# EAGLE design Charger Control Board rev9 (EAGLE 9.6.2)

## Sheet 1 of 4: Main
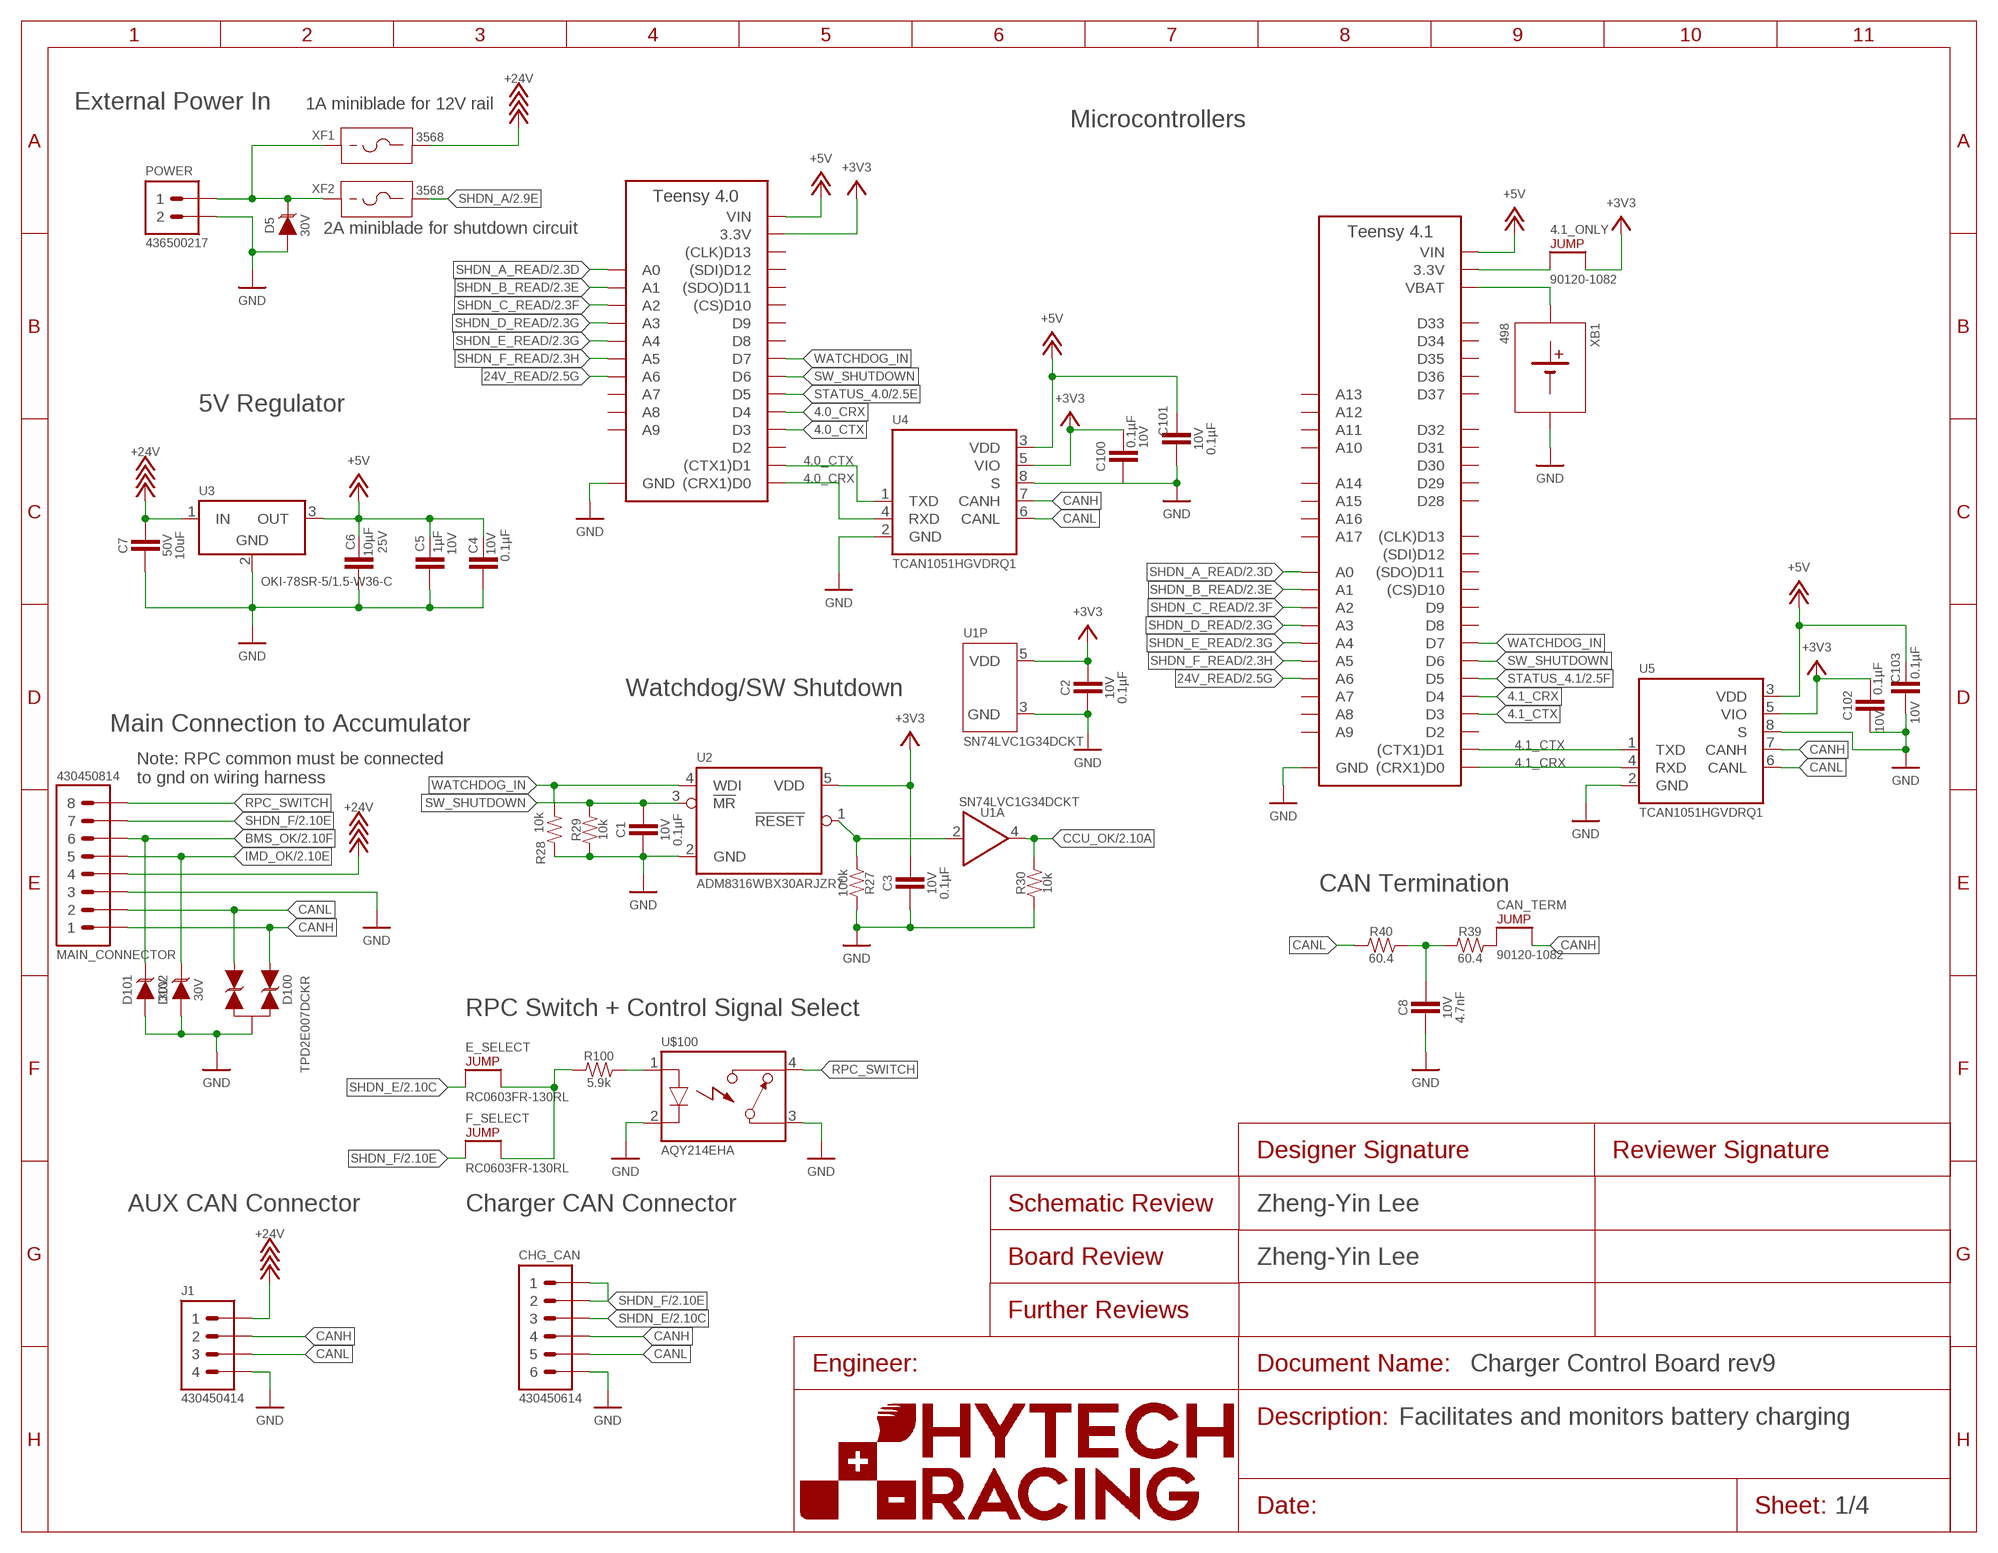
[diagram p0: schematic, sheet 1]
FRAME1 (FRAME): DESCRIPTION_1: Facilitates and monitors battery charging; DESIGNER_BOARD: Zheng-Yin Lee; DESIGNER_SCHEMATIC: Zheng-Yin Lee

### Parts
4.1_ONLY  JUMPER__1X02  [1X02]
A1  TEENSY_4.1  [TEENSY_LONG_EXT]
A2  TEENSY_4.0TH  [TEENSY_SHORT]
C1  CAPACITOR_0603_10V_0.1UF  [0603-CAP]
C2  CAPACITOR_0603_10V_0.1UF  [0603-CAP]
C3  CAPACITOR_0603_10V_0.1UF  [0603-CAP]
C4  CAPACITOR_0603_10V_0.1UF  [0603-CAP]
C5  CAPACITOR_0603_10V_1UF  [0603-CAP]
C6  CAPACITOR_0603_25V_10UF  [0603-CAP]
C7  CAPACITOR_0805_50V_10UF  [0805-CAP]
C8  CAPACITOR_0603_10V_4.7NF  [0603-CAP]
C100  CAPACITOR_0603_10V_0.1UF  [0603-CAP]
C101  CAPACITOR_0603_10V_0.1UF  [0603-CAP]
C102  CAPACITOR_0603_10V_0.1UF  [0603-CAP]
C103  CAPACITOR_0603_10V_0.1UF  [0603-CAP]
CAN_TERM  JUMPER__1X02  [1X02]
CHG_CAN  CONNECTOR-6_MF_T_V_  [MOLEX_MICROFIT_PTH_VERTICAL_06_DUAL]
D5  TVS_DO-214AA_30V  [DO-214AA]
D100  TVS_BIDIRECTIONAL_DUAL  [SC-70-3]
D101  TVS_DO-214AA_30V  [DO-214AA]
D102  TVS_DO-214AA_30V  [DO-214AA]
E_SELECT  JUMPER_0603_  [0603-RES]
F_SELECT  JUMPER_0603_  [0603-RES]
J1  CONNECTOR-4_μF_T_V_BLACK  [MOLEX_MICROFIT_PTH_VERTICAL_04_DUAL]
MAIN_CONNECTOR  CONNECTOR-8_MF_T_V_  [MOLEX_MICROFIT_PTH_VERTICAL_08_DUAL]
POWER  CONNECTOR-2_μF_T_V_  CONNECTOR-2_μF_T_V_BLACK  [MOLEX_MICROFIT_PTH_VERTICAL_02_DUAL]
R27  RESISTOR_0603_100K  [0603-RES]
R28  RESISTOR_0603_10K  [0603-RES]
R29  RESISTOR_0603_10K  [0603-RES]
R30  RESISTOR_0603_10K  [0603-RES]
R39  RESISTOR_0603_60.4  [0603-RES]
R40  RESISTOR_0603_60.4  [0603-RES]
R100  RESISTOR_0603_5.9K  [0603-RES]
U1  LOGICGATE_BUFFER  [SC-70-5]
U2  ADM8316WBX30  [SOT-23-5]
U3  VOLTAGE_REGULATOR_MODULE_OKI-78SR_5V  [OKI-78SR]
U4  TCAN1051HQV-Q1  [SOIC-08(NARROW,0.15")]
U5  TCAN1051HQV-Q1  [SOIC-08(NARROW,0.15")]
U$100  RELAY_SOLIDSTATE_NO_DIP-4  [DIP-4]
XB1  BATTERY_HOLDER_KEYSTONE_498  [498]
XF1  FUSE_HOLDER_MINIBLADEPTH  [3568]
XF2  FUSE_HOLDER_MINIBLADEPTH  [3568]

### Nets
4.0_CRX: A2.D0((CRX1)D0) A2.D4 U4.4(RXD)
4.0_CTX: A2.D1((CTX1)D1) A2.D3 U4.1(TXD)
4.1_CRX: A1.D0((CRX1)D0) A1.D4 U5.4(RXD)
4.1_CTX: A1.D1((CTX1)D1) A1.D3 U5.1(TXD)
24V_READ: A1.D20(A6) A2.D20(A6) ; also sheet 2
+3V3: 4.1_ONLY.2 A2.3.3V C2.2 C3.2 C100.2 C102.2 U1.5(P:VDD) U2.5(VDD) U4.5(VIO) U5.5(VIO) ; also sheet 2
+5V: A1.VIN A2.VIN C4.2 C5.1 C6.1 C101.2 C103.2 U3.3(OUT) U4.3(VDD) U5.3(VDD) ; also sheet 2
+24V: C7.1 J1.1 MAIN_CONNECTOR.4 U3.1(IN) XF1.3 XF1.4 ; also sheet 2
BMS_OK: D101.2(C) MAIN_CONNECTOR.6 ; also sheet 2
CANH: CAN_TERM.2 CHG_CAN.4 D100.1(C1) J1.2 MAIN_CONNECTOR.1 U4.7(CANH) U5.7(CANH)
CANL: CHG_CAN.5 D100.2(C2) J1.3 MAIN_CONNECTOR.2 R40.1 U4.6(CANL) U5.6(CANL)
CCU_OK: R30.2 U1.4(A:OUT) ; also sheet 2
GND: A1.AGND/GND(GND) A1.GND A1.GND@2(GND) A2.AGND/GND(GND) A2.GND C1.1 C2.1 C3.1 C4.1 C5.2 C6.2 C7.2 C8.2 C100.1 C101.1 C102.1 C103.1 CHG_CAN.6 D5.1(A) D100.3(A) D101.1(A) D102.1(A) J1.4 MAIN_CONNECTOR.3 POWER.2 R27.2 R28.2 R29.1 R30.1 U1.3(P:GND) U2.2(GND) U3.2(GND) U4.2(GND) U4.8(S) U5.2(GND) U5.8(S) U$100.2(CONTROL-) U$100.3(CONTACT1) XB1.2(MINUS) ; also sheet 2
IMD_OK: D102.2(C) MAIN_CONNECTOR.5 ; also sheet 2
N$1: D5.2(C) POWER.1 XF1.1 XF1.2 XF2.1 XF2.2
N$2: R27.1 U1.2(A:IN) U2.1(!RESET!)
N$4: CAN_TERM.1 R39.2
N$5: E_SELECT.2 F_SELECT.2 R100.1
N$8: A1.VBAT XB1.1(PLUS)
N$9: C8.1 R39.1 R40.2
N$10: R100.2 U$100.1(CONTROL+)
N$36: 4.1_ONLY.1 A1.3V3(3.3V) A1.3V3@2(3.3V) A1.3V3@3(3.3V)
RPC_SWITCH: MAIN_CONNECTOR.8 U$100.4(CONTACT2)
SHDN_A: XF2.3 XF2.4 ; also sheet 2
SHDN_A_READ: A1.D14(A0) A2.D14(A0) ; also sheet 2
SHDN_B_READ: A1.D15(A1) A2.D15(A1) ; also sheet 2
SHDN_C_READ: A1.D16(A2) A2.D16(A2) ; also sheet 2
SHDN_D_READ: A1.D17(A3) A2.D17(A3) ; also sheet 2
SHDN_E: CHG_CAN.3 E_SELECT.1 ; also sheet 2
SHDN_E_READ: A1.D18(A4) A2.D18(A4) ; also sheet 2
SHDN_F: CHG_CAN.1 CHG_CAN.2 F_SELECT.1 MAIN_CONNECTOR.7 ; also sheet 2
SHDN_F_READ: A1.D19(A5) A2.D19(A5) ; also sheet 2
STATUS_4.0: A2.D5 ; also sheet 2
STATUS_4.1: A1.D5 ; also sheet 2
SW_SHUTDOWN: A1.D6 A2.D6 C1.2 R29.2 U2.3(!MR!)
WATCHDOG_IN: A1.D7 A2.D7 R28.1 U2.4(WDI)
Unconnected: A1.D2 A1.D8 A1.D9 A1.D10((CS)D10) A1.D11((SDO)D11) A1.D12((SDI)D12) A1.D13((CLK)D13) A1.D21(A7) A1.D22(A8) A1.D23(A9) A1.D24(A10) A1.D25(A11) A1.D26(A12) A1.D27(A13) A1.D28 A1.D29 A1.D30 A1.D31 A1.D32 A1.D33 A1.D34 A1.D35 A1.D36 A1.D37 A1.D38(A14) A1.D39(A15) A1.D40(A16) A1.D41(A17) A2.D2 A2.D8 A2.D9 A2.D10((CS)D10) A2.D11((SDO)D11) A2.D12((SDI)D12) A2.D13((CLK)D13) A2.D21(A7) A2.D22(A8) A2.D23(A9)

### Notes on the sheet
- External Power In | 1A miniblade for 12V rail
- Microcontrollers
- 2A miniblade for shutdown circuit
- 5V Regulator
- Watchdog/SW Shutdown
- Main Connection to Accumulator
- Note: RPC common must be connected
  to gnd on wiring harness
- CAN Termination
- RPC Switch + Control Signal Select
- AUX CAN Connector | Charger CAN Connector

## Sheet 2 of 4: Shutdown Cicruit
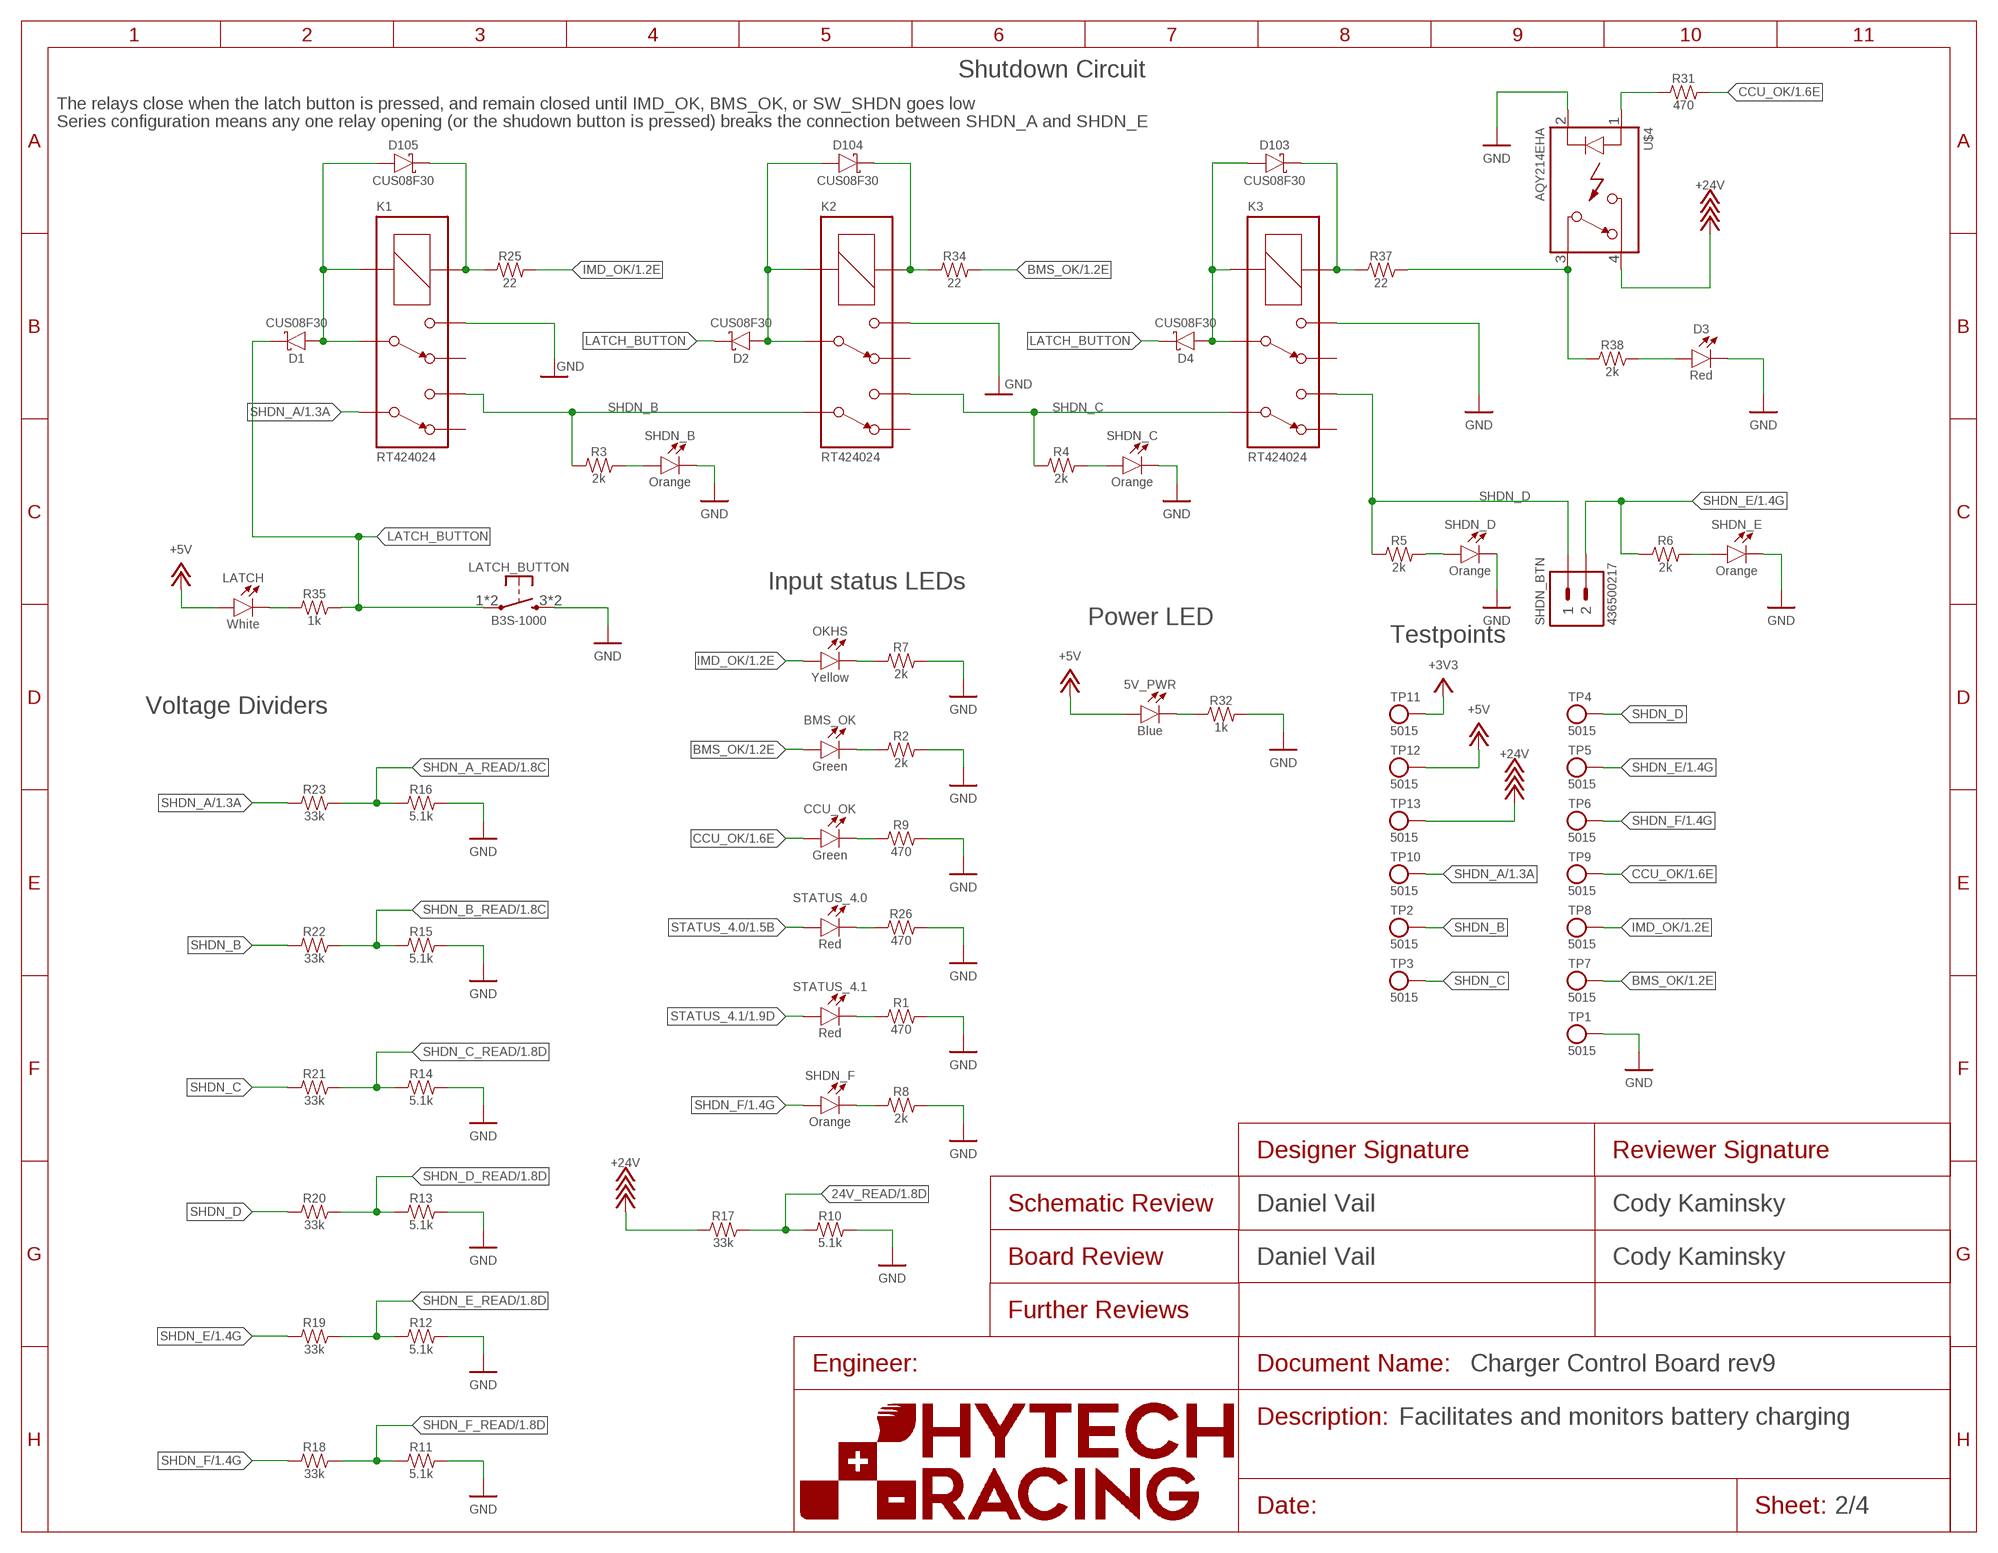
[diagram p1: schematic, sheet 2]
FRAME2 (FRAME): DESCRIPTION_1: Facilitates and monitors battery charging; DESIGNER_BOARD: Daniel Vail; DESIGNER_SCHEMATIC: Daniel Vail; REVIEWER_BOARD: Cody Kaminsky; REVIEWER_SCHEMATIC: Cody Kaminsky

### Parts
5V_PWR  LED_0603_BLUE  [0603-LED]
BMS_OK  LED_0603_GREEN  [0603-LED]
CCU_OK  LED_0603_GREEN  [0603-LED]
D1  SCHOTTKY_SOD323_30V  [SOD-323]
D2  SCHOTTKY_SOD323_30V  [SOD-323]
D3  LED_0603_RED  [0603-LED]
D4  SCHOTTKY_SOD323_30V  [SOD-323]
D103  SCHOTTKY_SOD323_30V  [SOD-323]
D104  SCHOTTKY_SOD323_30V  [SOD-323]
D105  SCHOTTKY_SOD323_30V  [SOD-323]
K1  RELAY_DPDT_RT424024TH  [RT*2*]
K2  RELAY_DPDT_RT424024TH  [RT*2*]
K3  RELAY_DPDT_RT424024TH  [RT*2*]
LATCH  LED_0603_WHITE  [0603-LED]
LATCH_BUTTON  BUTTON  [B3S-100X]
OKHS  LED_0603_YELLOW  [0603-LED]
R1  RESISTOR_0603_470  [0603-RES]
R2  RESISTOR_0603_2K  [0603-RES]
R3  RESISTOR_0603_2K  [0603-RES]
R4  RESISTOR_0603_2K  [0603-RES]
R5  RESISTOR_0603_2K  [0603-RES]
R6  RESISTOR_0603_2K  [0603-RES]
R7  RESISTOR_0603_2K  [0603-RES]
R8  RESISTOR_0603_2K  [0603-RES]
R9  RESISTOR_0603_470  [0603-RES]
R10  RESISTOR_0603_5.1K  [0603-RES]
R11  RESISTOR_0603_5.1K  [0603-RES]
R12  RESISTOR_0603_5.1K  [0603-RES]
R13  RESISTOR_0603_5.1K  [0603-RES]
R14  RESISTOR_0603_5.1K  [0603-RES]
R15  RESISTOR_0603_5.1K  [0603-RES]
R16  RESISTOR_0603_5.1K  [0603-RES]
R17  RESISTOR_0603_33K  [0603-RES]
R18  RESISTOR_0603_33K  [0603-RES]
R19  RESISTOR_0603_33K  [0603-RES]
R20  RESISTOR_0603_33K  [0603-RES]
R21  RESISTOR_0603_33K  [0603-RES]
R22  RESISTOR_0603_33K  [0603-RES]
R23  RESISTOR_0603_33K  [0603-RES]
R25  RESISTOR_0603_22  [0603-RES]
R26  RESISTOR_0603_470  [0603-RES]
R31  RESISTOR_0603_470  [0603-RES]
R32  RESISTOR_0603_1K  [0603-RES]
R34  RESISTOR_0603_22  [0603-RES]
R35  RESISTOR_0603_1K  [0603-RES]
R37  RESISTOR_0603_22  [0603-RES]
R38  RESISTOR_0603_2K  [0603-RES]
SHDN_B  LED_0603_ORANGE  [0603-LED]
SHDN_BTN  CONNECTOR-2_μF_T_V_  CONNECTOR-2_μF_T_V_BLACK  [MOLEX_MICROFIT_PTH_VERTICAL_02_DUAL]
SHDN_C  LED_0603_ORANGE  [0603-LED]
SHDN_D  LED_0603_ORANGE  [0603-LED]
SHDN_E  LED_0603_ORANGE  [0603-LED]
SHDN_F  LED_0603_ORANGE  [0603-LED]
STATUS_4.0  LED_0603_RED  [0603-LED]
STATUS_4.1  LED_0603_RED  [0603-LED]
TP1  TEST_POINT  [5015]
TP2  TEST_POINT  [5015]
TP3  TEST_POINT  [5015]
TP4  TEST_POINT  [5015]
TP5  TEST_POINT  [5015]
TP6  TEST_POINT  [5015]
TP7  TEST_POINT  [5015]
TP8  TEST_POINT  [5015]
TP9  TEST_POINT  [5015]
TP10  TEST_POINT  [5015]
TP11  TEST_POINT  [5015]
TP12  TEST_POINT  [5015]
TP13  TEST_POINT  [5015]
U$4  RELAY_SOLIDSTATE_NO  [DIP-4@1]

### Nets
24V_READ: R10.1 R17.2 ; also sheet 1
+3V3: TP11.1 ; also sheet 1
+5V: 5V_PWR.2(A) LATCH.2(A) TP12.1 ; also sheet 1
+24V: R17.1 TP13.1 U$4.4(CONTACT2) ; also sheet 1
BMS_OK: BMS_OK.2(A) R34.2 TP7.1 ; also sheet 1
CCU_OK: CCU_OK.2(A) R31.2 TP9.1 ; also sheet 1
GND: D3.1(C) K1.14 K2.14 K3.14 LATCH_BUTTON.3(S) LATCH_BUTTON.4(S) R1.2 R2.2 R7.2 R8.2 R9.2 R10.2 R11.2 R12.2 R13.2 R14.2 R15.2 R16.2 R26.2 R32.2 SHDN_B.1(C) SHDN_C.1(C) SHDN_D.1(C) SHDN_E.1(C) TP1.1 U$4.2(CONTROL-) ; also sheet 1
IMD_OK: OKHS.2(A) R25.2 TP8.1 ; also sheet 1
LATCH_BUTTON: D1.C D2.C D4.C LATCH_BUTTON.1(P) LATCH_BUTTON.2(P) R35.2
N$3: R8.1 SHDN_F.1(C)
N$6: R31.1 U$4.1(CONTROL+)
N$11: D1.A D105.A K1.11 K1.A2(COIL-)
N$12: D105.C K1.A1(COIL+) R25.1
N$13: D104.C K2.A1(COIL+) R34.1
N$14: D2.A D104.A K2.11 K2.A2(COIL-)
N$15: D103.C K3.A1(COIL+) R37.1
N$16: R37.2 R38.1 U$4.3(CONTACT1)
N$17: LATCH.1(C) R35.1
N$18: R5.2 SHDN_D.2(A)
N$19: R6.2 SHDN_E.2(A)
N$20: D4.A D103.A K3.11 K3.A2(COIL-)
N$21: D3.2(A) R38.2
N$22: R4.2 SHDN_C.2(A)
N$23: R3.2 SHDN_B.2(A)
N$29: OKHS.1(C) R7.1
N$30: BMS_OK.1(C) R2.1
N$31: CCU_OK.1(C) R9.1
N$33: R26.1 STATUS_4.0.1(C)
N$35: 5V_PWR.1(C) R32.1
N$39: R1.1 STATUS_4.1.1(C)
SHDN_A: K1.21 R23.1 TP10.1 ; also sheet 1
SHDN_A_READ: R16.1 R23.2 ; also sheet 1
SHDN_B: K1.24 K2.21 R3.1 R22.1 TP2.1
SHDN_B_READ: R15.1 R22.2 ; also sheet 1
SHDN_C: K2.24 K3.21 R4.1 R21.1 TP3.1
SHDN_C_READ: R14.1 R21.2 ; also sheet 1
SHDN_D: K3.24 R5.1 R20.1 SHDN_BTN.1 TP4.1
SHDN_D_READ: R13.1 R20.2 ; also sheet 1
SHDN_E: R6.1 R19.1 SHDN_BTN.2 TP5.1 ; also sheet 1
SHDN_E_READ: R12.1 R19.2 ; also sheet 1
SHDN_F: R18.1 SHDN_F.2(A) TP6.1 ; also sheet 1
SHDN_F_READ: R11.1 R18.2 ; also sheet 1
STATUS_4.0: STATUS_4.0.2(A) ; also sheet 1
STATUS_4.1: STATUS_4.1.2(A) ; also sheet 1
Unconnected: K1.12 K1.22 K2.12 K2.22 K3.12 K3.22

### Notes on the sheet
- Shutdown Circuit
- The relays close when the latch button is pressed, and remain closed until IMD_OK, BMS_OK, or SW_SHDN goes low
- Series configuration means any one relay opening (or the shudown button is pressed) breaks the connection between SHDN_A and SHDN_E
- Input status LEDs
- Power LED
- Testpoints
- Voltage Dividers

## Sheet 3 of 4
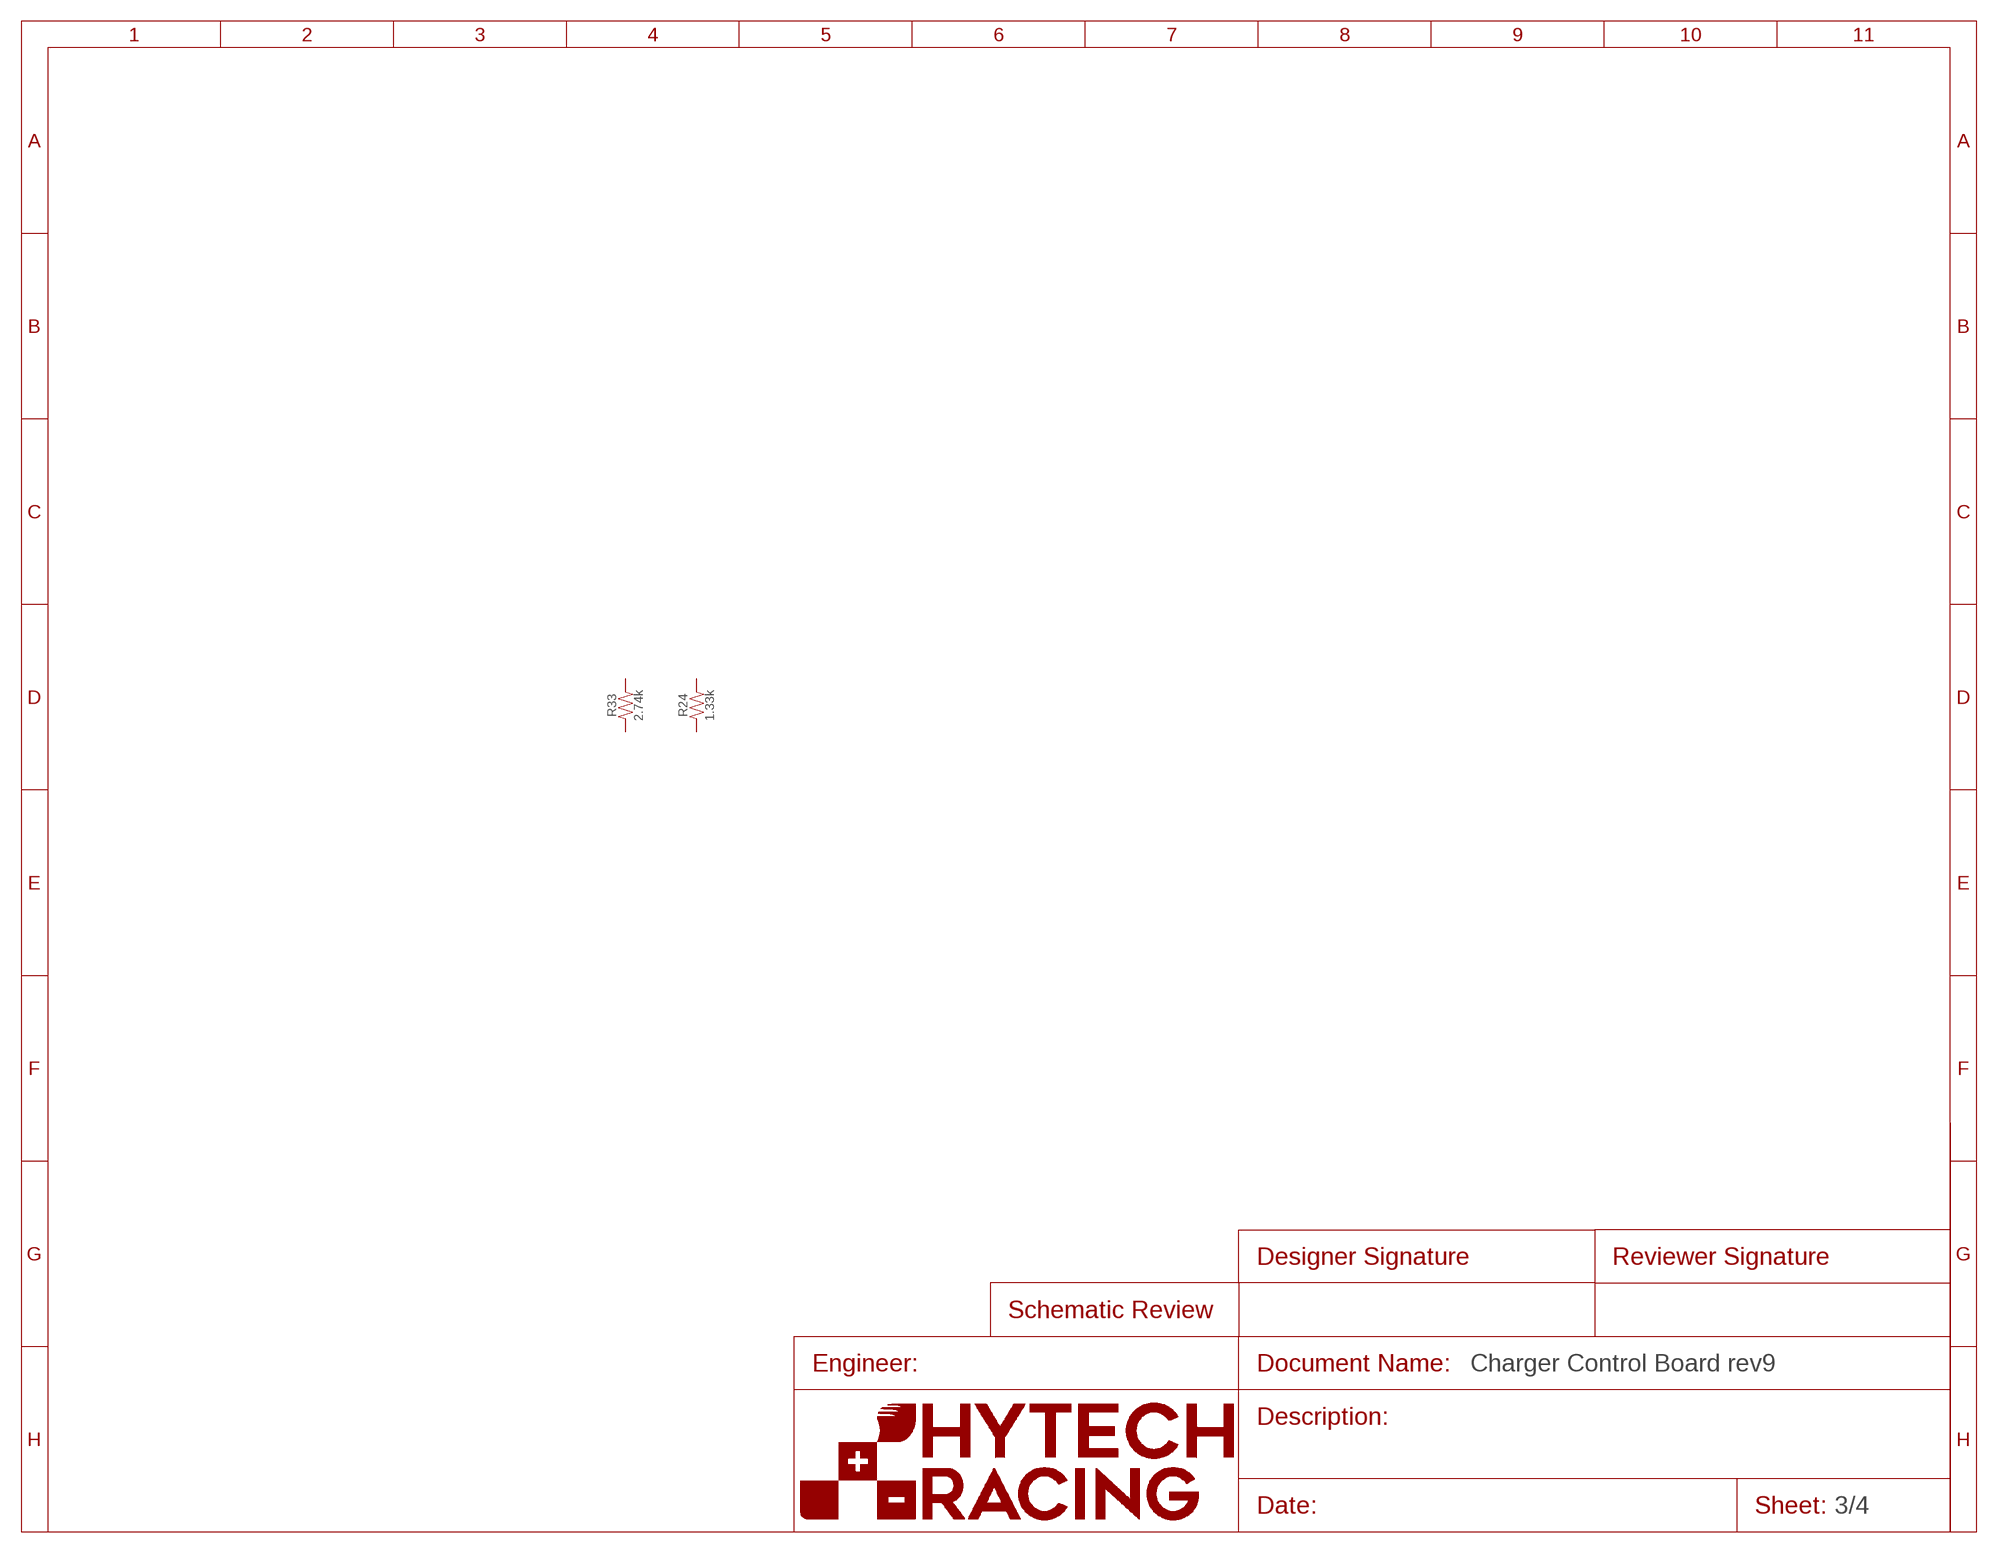
[diagram p2: schematic, sheet 3]

### Parts
R24  RESISTOR_0603_1.33K  [0603-RES]
R33  RESISTOR_0603_2.74K  [0603-RES]
Unconnected: R24.1 R24.2 R33.1 R33.2

## Sheet 4 of 4: Ordering Components
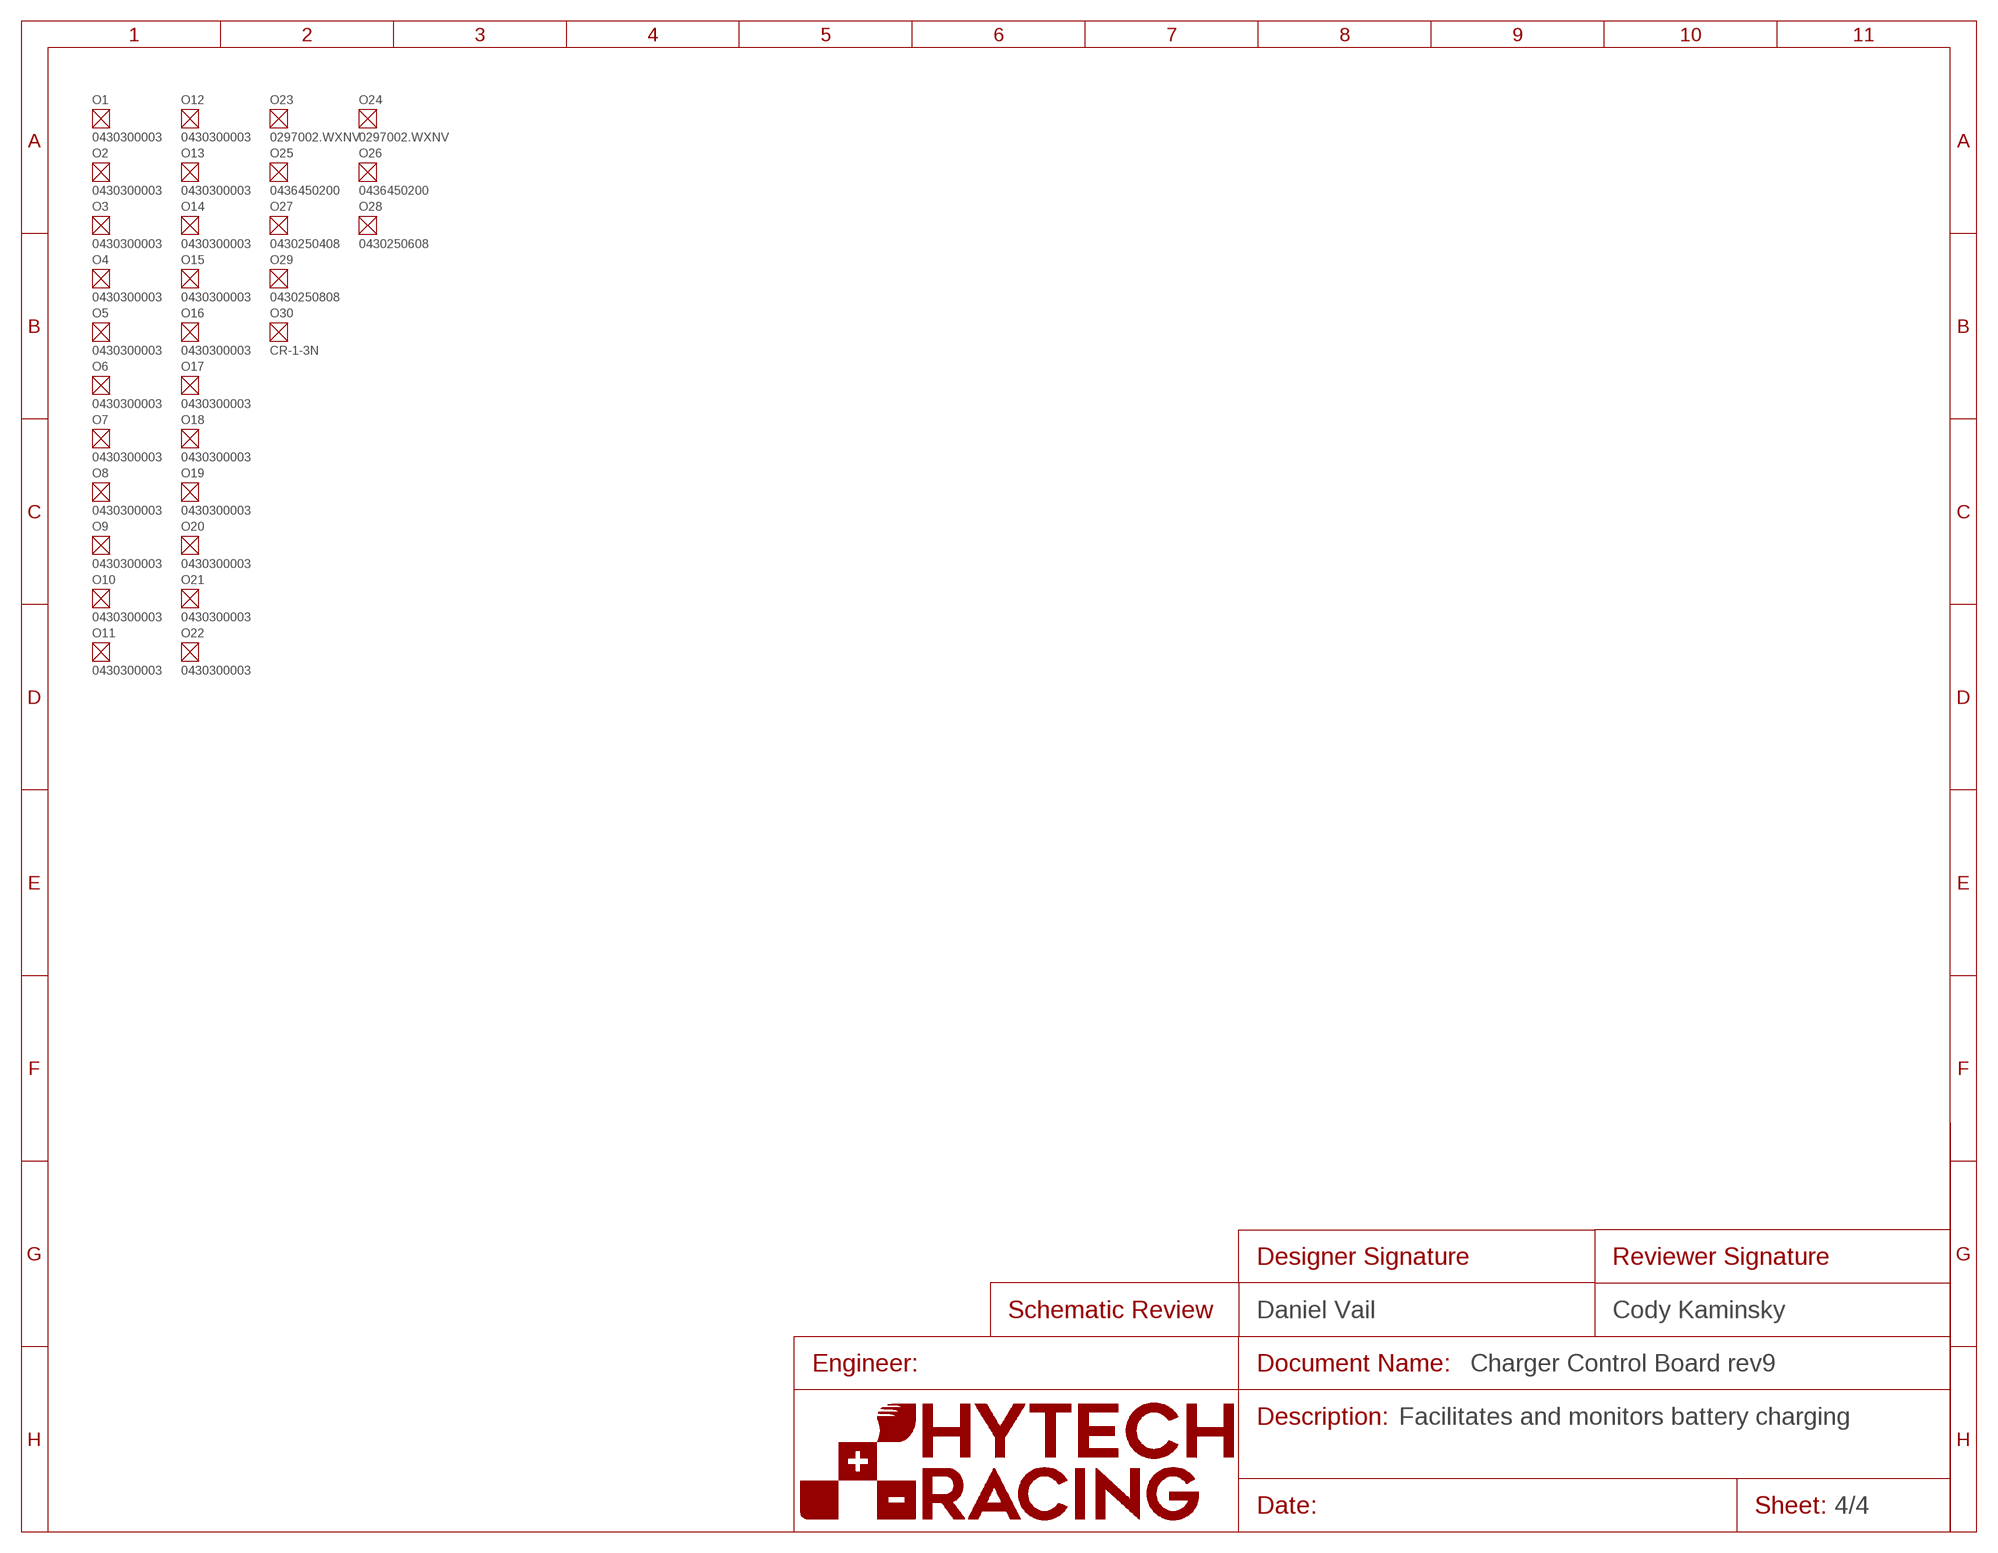
[diagram p3: schematic, sheet 4]
O1 (CRIMP_MICROFIT_20-24): DKPN: WM2776CT-ND; GAUGE: 20-24; MANUFACTURER: Molex; MOPN: 538-43030-0003; MPN: 0430300003
O2 (CRIMP_MICROFIT_20-24): DKPN: WM2776CT-ND; GAUGE: 20-24; MANUFACTURER: Molex; MOPN: 538-43030-0003; MPN: 0430300003
O3 (CRIMP_MICROFIT_20-24): DKPN: WM2776CT-ND; GAUGE: 20-24; MANUFACTURER: Molex; MOPN: 538-43030-0003; MPN: 0430300003
O4 (CRIMP_MICROFIT_20-24): DKPN: WM2776CT-ND; GAUGE: 20-24; MANUFACTURER: Molex; MOPN: 538-43030-0003; MPN: 0430300003
O5 (CRIMP_MICROFIT_20-24): DKPN: WM2776CT-ND; GAUGE: 20-24; MANUFACTURER: Molex; MOPN: 538-43030-0003; MPN: 0430300003
O6 (CRIMP_MICROFIT_20-24): DKPN: WM2776CT-ND; GAUGE: 20-24; MANUFACTURER: Molex; MOPN: 538-43030-0003; MPN: 0430300003
O7 (CRIMP_MICROFIT_20-24): DKPN: WM2776CT-ND; GAUGE: 20-24; MANUFACTURER: Molex; MOPN: 538-43030-0003; MPN: 0430300003
O8 (CRIMP_MICROFIT_20-24): DKPN: WM2776CT-ND; GAUGE: 20-24; MANUFACTURER: Molex; MOPN: 538-43030-0003; MPN: 0430300003
O9 (CRIMP_MICROFIT_20-24): DKPN: WM2776CT-ND; GAUGE: 20-24; MANUFACTURER: Molex; MOPN: 538-43030-0003; MPN: 0430300003
O10 (CRIMP_MICROFIT_20-24): DKPN: WM2776CT-ND; GAUGE: 20-24; MANUFACTURER: Molex; MOPN: 538-43030-0003; MPN: 0430300003
O11 (CRIMP_MICROFIT_20-24): DKPN: WM2776CT-ND; GAUGE: 20-24; MANUFACTURER: Molex; MOPN: 538-43030-0003; MPN: 0430300003
O12 (CRIMP_MICROFIT_20-24): DKPN: WM2776CT-ND; GAUGE: 20-24; MANUFACTURER: Molex; MOPN: 538-43030-0003; MPN: 0430300003
O13 (CRIMP_MICROFIT_20-24): DKPN: WM2776CT-ND; GAUGE: 20-24; MANUFACTURER: Molex; MOPN: 538-43030-0003; MPN: 0430300003
O14 (CRIMP_MICROFIT_20-24): DKPN: WM2776CT-ND; GAUGE: 20-24; MANUFACTURER: Molex; MOPN: 538-43030-0003; MPN: 0430300003
O15 (CRIMP_MICROFIT_20-24): DKPN: WM2776CT-ND; GAUGE: 20-24; MANUFACTURER: Molex; MOPN: 538-43030-0003; MPN: 0430300003
O16 (CRIMP_MICROFIT_20-24): DKPN: WM2776CT-ND; GAUGE: 20-24; MANUFACTURER: Molex; MOPN: 538-43030-0003; MPN: 0430300003
O17 (CRIMP_MICROFIT_20-24): DKPN: WM2776CT-ND; GAUGE: 20-24; MANUFACTURER: Molex; MOPN: 538-43030-0003; MPN: 0430300003
O18 (CRIMP_MICROFIT_20-24): DKPN: WM2776CT-ND; GAUGE: 20-24; MANUFACTURER: Molex; MOPN: 538-43030-0003; MPN: 0430300003
O19 (CRIMP_MICROFIT_20-24): DKPN: WM2776CT-ND; GAUGE: 20-24; MANUFACTURER: Molex; MOPN: 538-43030-0003; MPN: 0430300003
O20 (CRIMP_MICROFIT_20-24): DKPN: WM2776CT-ND; GAUGE: 20-24; MANUFACTURER: Molex; MOPN: 538-43030-0003; MPN: 0430300003
O21 (CRIMP_MICROFIT_20-24): DKPN: WM2776CT-ND; GAUGE: 20-24; MANUFACTURER: Molex; MOPN: 538-43030-0003; MPN: 0430300003
O22 (CRIMP_MICROFIT_20-24): DKPN: WM2776CT-ND; GAUGE: 20-24; MANUFACTURER: Molex; MOPN: 538-43030-0003; MPN: 0430300003
O23 (FUSE_MINI_BLADE_2): CURRENT: 2A; DKPN: F986-ND; FUSE_TYPE: MINI 297; MANUFACTURER: Littelfuse Inc.; MOPN: 576-0297002.WXNV; MPN: 0297002.WXNV
O24 (FUSE_MINI_BLADE_2): CURRENT: 2A; DKPN: F986-ND; FUSE_TYPE: MINI 297; MANUFACTURER: Littelfuse Inc.; MOPN: 576-0297002.WXNV; MPN: 0297002.WXNV
O25 (RECEPTACLE-2_MICROFIT): DKPN: WM1845-ND; MANUFACTURER: Molex; MOPN: 538-43645-0200; MPN: 0436450200
O26 (RECEPTACLE-2_MICROFIT): DKPN: WM1845-ND; MANUFACTURER: Molex; MOPN: 538-43645-0200; MPN: 0436450200
O27 (RECEPTACLE-4_MICROFIT): DKPN: WM11225-ND; MANUFACTURER: Molex; MOPN: 538-43025-0408; MPN: 0430250408
O28 (RECEPTACLE-6_MICROFIT): DKPN: WM13209-ND; MANUFACTURER: Molex; MOPN: 538-43025-0608; MPN: 0430250608
O29 (RECEPTACLE-8_MICROFIT): DKPN: WM13210-ND; MANUFACTURER: Molex; MOPN: 538-43025-0808; MPN: 0430250808
O30 (BATTERY_CR-1/3N): BATTERY_TYPE: 1/3N; DKPN: SY100-ND; MANUFACTURER: FDK America, Inc., a member of Fujitsu Group; MOPN: 639-CR1/3N; MPN: CR-1-3N; VOLTAGE: 3V
U$8 (FRAME_SCHEMATIC_ONLY): DESCRIPTION_1: Facilitates and monitors battery charging; DESIGNER_SCHEMATIC: Daniel Vail; REVIEWER_SCHEMATIC: Cody Kaminsky

## Library data of the parts
4.1_ONLY CAN_TERM = HyTechDevices_Jumper:JUMPER_?_*: 2 Pin Connector; DKPN: WM23656-ND; MANUFACTURER: Molex; MOPN: 538-90120-1082; MPN: 90120-1082
5V_PWR = HyTechDevices:LED_?_*: LED 0603 Blue <https://www.mouser.com/datasheet/2/216/APT1608VBC_D-246010.pdf> Green <https://www.mouser.com/datasheet/2/216/APT1608ZGCK-1173388.pdf> Orange <https://www.mouser.com/datasheet/2/216/APT1608SECK-6197.pdf> Red <https://www.mouser.com/datasheet/2/216/APT1608SECK-J3-PRV-1173336.pdf> White <https://www.mouser.com/datasheet/2/50/SM0603UWC-880813.pdf> Yellow <https://www.mouser.com/datasheet/2/216/APT1608SYCK-J3-PRV-1173311.pdf> 2835 (Series not on Digikey) Lumiled LUXEON 2835 Color Line <https://www.mouser.com/datasheet/2/602/DS236_luxeon_2835_color_line_datasheet-1596094.pdf>; COLOR: Blue; DKPN: 754-1789-1-ND; MANUFACTURER: Kingbright; MOPN: 604-APT1608VBC/D; MPN: APT1608VBC/D
A1 = HyTechDevices:TEENSY_4.1: Teensy 4.1 with VBAT Datasheet <https://www.pjrc.com/store/teensy41.html#pins> Requires ordering of: 2: 24 pin, 0.1" pitch female headers 1: 2 pin, 0.1" pitch female headers; TEENSY: 4.1
A2 = HyTechDevices:TEENSY_4.0: Teensy 4.0 Datasheet <https://www.pjrc.com/store/teensy40.html> Requires ordering of: 2: 14 pin, 0.1" pitch female headers. Recommend Samtec SSM-114-L-SV for surface mount variant.; TEENSY: 4.0
BMS_OK CCU_OK = HyTechDevices:LED_?_*: LED 0603 Blue <https://www.mouser.com/datasheet/2/216/APT1608VBC_D-246010.pdf> Green <https://www.mouser.com/datasheet/2/216/APT1608ZGCK-1173388.pdf> Orange <https://www.mouser.com/datasheet/2/216/APT1608SECK-6197.pdf> Red <https://www.mouser.com/datasheet/2/216/APT1608SECK-J3-PRV-1173336.pdf> White <https://www.mouser.com/datasheet/2/50/SM0603UWC-880813.pdf> Yellow <https://www.mouser.com/datasheet/2/216/APT1608SYCK-J3-PRV-1173311.pdf> 2835 (Series not on Digikey) Lumiled LUXEON 2835 Color Line <https://www.mouser.com/datasheet/2/602/DS236_luxeon_2835_color_line_datasheet-1596094.pdf>; COLOR: Green; DKPN: 754-1790-1-ND; MANUFACTURER: Kingbright; MOPN: 604-APT1608ZGCK; MPN: APT1608ZGCK
C1-C4 C100-C103 = HyTechDevices:CAPACITOR_?_*: Capacitor, Non-Polarized VJ...1BC Series Datasheet <https://www.mouser.com/datasheet/2/427/vjw1bcbascomseries-1762447.pdf> Samsung Datasheet <https://www.mouser.com/datasheet/2/585/MLCC-1837944.pdf> Walsin Datasheet <https://www.mouser.com/datasheet/2/210/WTC_MLCC_General_Purpose-1534899.pdf> GRM188R61A226ME15D <https://www.mouser.com/datasheet/2/281/1/GRM188R61A226ME15_02A-1985787.pdf> GRM188R61E106MA73D <https://www.mouser.com/datasheet/2/281/1/GRM188R61E106MA73_01A-1985806.pdf> 885012006013 <https://www.mouser.com/datasheet/2/445/885012006013-1726946.pdf> 2220Y6300105KXTWS2 <https://www.mouser.com/datasheet/2/218/SMD_High_and_Std_StackiCap_P62-1825512.pdf> Yageo Class 2, X5R <https://www.mouser.com/datasheet/2/447/UPY_GPHC_X5R_4V_to_50V_26-1827097.pdf> TDK C Series <https://www.mouser.com/ProductDetail/TDK/C3216X5R1V226M160AC?qs=%2Fha2pyFadujbcx9jh7lYl%2F4NeMoXFhdc8AqVWNq4wW6M2y7zl6GzBuhgtI0ngznN> AVX Automotive MLCC <https://www.mouser.com/datasheet/2/40/AutoMLCC-777028.pdf> KEMET X7R Series <https://www.mouser.com/datasheet/2/212/KEM_C1002_X7R_SMD-1102033.pdf> Kyocera AVX <https://www.mouser.com/datasheet/2/40/C0GNP0_Dielectric-951274.pdf> GRM21BR61H <https://www.mouser.com/datasheet/2/281/1/GRM21BR61H106KE43_01A-1986884.pdf> C1812W104KDRACTU <https://www.mouser.com/datasheet/2/212/KEM_C1034_X7R_HV_ARC_SMD-1101730.pdf>; CAPACITANCE: 0.1µF; DKPN: 720-1688-1-ND; MANUFACTURER: Vishay Vitramon; MOPN: 77-VJ0603Y104JXQPBC; MPN: VJ0603Y104JXQPW1BC; TOLERANCE: 5%; VOLTAGE: 10V
C5 = HyTechDevices:CAPACITOR_?_*: Capacitor, Non-Polarized VJ...1BC Series Datasheet <https://www.mouser.com/datasheet/2/427/vjw1bcbascomseries-1762447.pdf> Samsung Datasheet <https://www.mouser.com/datasheet/2/585/MLCC-1837944.pdf> Walsin Datasheet <https://www.mouser.com/datasheet/2/210/WTC_MLCC_General_Purpose-1534899.pdf> GRM188R61A226ME15D <https://www.mouser.com/datasheet/2/281/1/GRM188R61A226ME15_02A-1985787.pdf> GRM188R61E106MA73D <https://www.mouser.com/datasheet/2/281/1/GRM188R61E106MA73_01A-1985806.pdf> 885012006013 <https://www.mouser.com/datasheet/2/445/885012006013-1726946.pdf> 2220Y6300105KXTWS2 <https://www.mouser.com/datasheet/2/218/SMD_High_and_Std_StackiCap_P62-1825512.pdf> Yageo Class 2, X5R <https://www.mouser.com/datasheet/2/447/UPY_GPHC_X5R_4V_to_50V_26-1827097.pdf> TDK C Series <https://www.mouser.com/ProductDetail/TDK/C3216X5R1V226M160AC?qs=%2Fha2pyFadujbcx9jh7lYl%2F4NeMoXFhdc8AqVWNq4wW6M2y7zl6GzBuhgtI0ngznN> AVX Automotive MLCC <https://www.mouser.com/datasheet/2/40/AutoMLCC-777028.pdf> KEMET X7R Series <https://www.mouser.com/datasheet/2/212/KEM_C1002_X7R_SMD-1102033.pdf> Kyocera AVX <https://www.mouser.com/datasheet/2/40/C0GNP0_Dielectric-951274.pdf> GRM21BR61H <https://www.mouser.com/datasheet/2/281/1/GRM21BR61H106KE43_01A-1986884.pdf> C1812W104KDRACTU <https://www.mouser.com/datasheet/2/212/KEM_C1034_X7R_HV_ARC_SMD-1101730.pdf>; CAPACITANCE: 1µF; DKPN: 311-1796-1-ND; MANUFACTURER: Yageo; MOPN: 603-CC603KRX7R6BB105; MPN: CC0603KRX7R6BB105; TOLERANCE: 10%; VOLTAGE: 10V
C6 = HyTechDevices:CAPACITOR_?_*: Capacitor, Non-Polarized VJ...1BC Series Datasheet <https://www.mouser.com/datasheet/2/427/vjw1bcbascomseries-1762447.pdf> Samsung Datasheet <https://www.mouser.com/datasheet/2/585/MLCC-1837944.pdf> Walsin Datasheet <https://www.mouser.com/datasheet/2/210/WTC_MLCC_General_Purpose-1534899.pdf> GRM188R61A226ME15D <https://www.mouser.com/datasheet/2/281/1/GRM188R61A226ME15_02A-1985787.pdf> GRM188R61E106MA73D <https://www.mouser.com/datasheet/2/281/1/GRM188R61E106MA73_01A-1985806.pdf> 885012006013 <https://www.mouser.com/datasheet/2/445/885012006013-1726946.pdf> 2220Y6300105KXTWS2 <https://www.mouser.com/datasheet/2/218/SMD_High_and_Std_StackiCap_P62-1825512.pdf> Yageo Class 2, X5R <https://www.mouser.com/datasheet/2/447/UPY_GPHC_X5R_4V_to_50V_26-1827097.pdf> TDK C Series <https://www.mouser.com/ProductDetail/TDK/C3216X5R1V226M160AC?qs=%2Fha2pyFadujbcx9jh7lYl%2F4NeMoXFhdc8AqVWNq4wW6M2y7zl6GzBuhgtI0ngznN> AVX Automotive MLCC <https://www.mouser.com/datasheet/2/40/AutoMLCC-777028.pdf> KEMET X7R Series <https://www.mouser.com/datasheet/2/212/KEM_C1002_X7R_SMD-1102033.pdf> Kyocera AVX <https://www.mouser.com/datasheet/2/40/C0GNP0_Dielectric-951274.pdf> GRM21BR61H <https://www.mouser.com/datasheet/2/281/1/GRM21BR61H106KE43_01A-1986884.pdf> C1812W104KDRACTU <https://www.mouser.com/datasheet/2/212/KEM_C1034_X7R_HV_ARC_SMD-1101730.pdf>; CAPACITANCE: 10µF; DKPN: 490-7202-1-ND; MANUFACTURER: Murata Electronics; MOPN: 81-GRM188R61E106MA3D; MPN: GRM188R61E106MA73D; TOLERANCE: 20%; VOLTAGE: 25V
C7 = HyTechDevices:CAPACITOR_?_*: Capacitor, Non-Polarized VJ...1BC Series Datasheet <https://www.mouser.com/datasheet/2/427/vjw1bcbascomseries-1762447.pdf> Samsung Datasheet <https://www.mouser.com/datasheet/2/585/MLCC-1837944.pdf> Walsin Datasheet <https://www.mouser.com/datasheet/2/210/WTC_MLCC_General_Purpose-1534899.pdf> GRM188R61A226ME15D <https://www.mouser.com/datasheet/2/281/1/GRM188R61A226ME15_02A-1985787.pdf> GRM188R61E106MA73D <https://www.mouser.com/datasheet/2/281/1/GRM188R61E106MA73_01A-1985806.pdf> 885012006013 <https://www.mouser.com/datasheet/2/445/885012006013-1726946.pdf> 2220Y6300105KXTWS2 <https://www.mouser.com/datasheet/2/218/SMD_High_and_Std_StackiCap_P62-1825512.pdf> Yageo Class 2, X5R <https://www.mouser.com/datasheet/2/447/UPY_GPHC_X5R_4V_to_50V_26-1827097.pdf> TDK C Series <https://www.mouser.com/ProductDetail/TDK/C3216X5R1V226M160AC?qs=%2Fha2pyFadujbcx9jh7lYl%2F4NeMoXFhdc8AqVWNq4wW6M2y7zl6GzBuhgtI0ngznN> AVX Automotive MLCC <https://www.mouser.com/datasheet/2/40/AutoMLCC-777028.pdf> KEMET X7R Series <https://www.mouser.com/datasheet/2/212/KEM_C1002_X7R_SMD-1102033.pdf> Kyocera AVX <https://www.mouser.com/datasheet/2/40/C0GNP0_Dielectric-951274.pdf> GRM21BR61H <https://www.mouser.com/datasheet/2/281/1/GRM21BR61H106KE43_01A-1986884.pdf> C1812W104KDRACTU <https://www.mouser.com/datasheet/2/212/KEM_C1034_X7R_HV_ARC_SMD-1101730.pdf>; CAPACITANCE: 10uF; DKPN: 490-18663-2-ND; MANUFACTURER: Murata; MOPN: 81-GRM21BR61H106KE3L; MPN: GRM21BR61H106KE43L; TOLERANCE: 10%; VOLTAGE: 50V
C8 = HyTechDevices:CAPACITOR_?_*: Capacitor, Non-Polarized VJ...1BC Series Datasheet <https://www.mouser.com/datasheet/2/427/vjw1bcbascomseries-1762447.pdf> Samsung Datasheet <https://www.mouser.com/datasheet/2/585/MLCC-1837944.pdf> Walsin Datasheet <https://www.mouser.com/datasheet/2/210/WTC_MLCC_General_Purpose-1534899.pdf> GRM188R61A226ME15D <https://www.mouser.com/datasheet/2/281/1/GRM188R61A226ME15_02A-1985787.pdf> GRM188R61E106MA73D <https://www.mouser.com/datasheet/2/281/1/GRM188R61E106MA73_01A-1985806.pdf> 885012006013 <https://www.mouser.com/datasheet/2/445/885012006013-1726946.pdf> 2220Y6300105KXTWS2 <https://www.mouser.com/datasheet/2/218/SMD_High_and_Std_StackiCap_P62-1825512.pdf> Yageo Class 2, X5R <https://www.mouser.com/datasheet/2/447/UPY_GPHC_X5R_4V_to_50V_26-1827097.pdf> TDK C Series <https://www.mouser.com/ProductDetail/TDK/C3216X5R1V226M160AC?qs=%2Fha2pyFadujbcx9jh7lYl%2F4NeMoXFhdc8AqVWNq4wW6M2y7zl6GzBuhgtI0ngznN> AVX Automotive MLCC <https://www.mouser.com/datasheet/2/40/AutoMLCC-777028.pdf> KEMET X7R Series <https://www.mouser.com/datasheet/2/212/KEM_C1002_X7R_SMD-1102033.pdf> Kyocera AVX <https://www.mouser.com/datasheet/2/40/C0GNP0_Dielectric-951274.pdf> GRM21BR61H <https://www.mouser.com/datasheet/2/281/1/GRM21BR61H106KE43_01A-1986884.pdf> C1812W104KDRACTU <https://www.mouser.com/datasheet/2/212/KEM_C1034_X7R_HV_ARC_SMD-1101730.pdf>; CAPACITANCE: 4.7nF; DKPN: 732-7931-1-ND; MANUFACTURER: Würth Elektronik; MOPN: 710-885012206012; MPN: 885012206012; TOLERANCE: 10%; VOLTAGE: 10V
CHG_CAN = HyTechDevices - Copy:CONNECTOR-6_?_*: 6 Pin Connector; MANUFACTURER: MOLEX; MPN: 430450614
D1 D2 D4 D103-D105 = HyTechDevices:SCHOTTKY_?_*: CUS08F30 Shottky Diode Datasheet <https://www.mouser.com/datasheet/2/408/CUS08F30_datasheet_en_20140414-1916097.pdf>; CURRENT: 0.8A; DKPN: CUS08F30H3FTR-ND; MANUFACTURER: Toshiba Semiconductor and Storage; MOPN: 757-CUS08F30H3F; MPN: CUS08F30; VOLTAGE: 30V
D3 STATUS_4.0 STATUS_4.1 = HyTechDevices:LED_?_*: LED 0603 Blue <https://www.mouser.com/datasheet/2/216/APT1608VBC_D-246010.pdf> Green <https://www.mouser.com/datasheet/2/216/APT1608ZGCK-1173388.pdf> Orange <https://www.mouser.com/datasheet/2/216/APT1608SECK-6197.pdf> Red <https://www.mouser.com/datasheet/2/216/APT1608SECK-J3-PRV-1173336.pdf> White <https://www.mouser.com/datasheet/2/50/SM0603UWC-880813.pdf> Yellow <https://www.mouser.com/datasheet/2/216/APT1608SYCK-J3-PRV-1173311.pdf> 2835 (Series not on Digikey) Lumiled LUXEON 2835 Color Line <https://www.mouser.com/datasheet/2/602/DS236_luxeon_2835_color_line_datasheet-1596094.pdf>; COLOR: Red; DKPN: 754-1786-1-ND; MANUFACTURER: Kingbright; MOPN: 604-APT1608SECKJ3PRV; MPN: APT1608SECK/J3-PRV
D5 D101 D102 = HyTechDevices:TVS_?_*: TVS Diode GSOT Datasheet <https://www.mouser.com/datasheet/2/427/gsot03-1767593.pdf>; DKPN: 118-1.5SMBJ30ATR-ND; MANUFACTURER: Bourns Inc.; MOPN: 652-1.5SMBJ30A; MPN: 1.5SMBJ30A; VOLTAGE: 30V
D100 = HyTechDevices:TVS_BIDIRECTIONAL_DUAL: Bdirectional TVS for CAN ESD Datasheet <https://www.ti.com/lit/ds/symlink/tpd2e007.pdf?HQS=dis-mous-null-mousermode-dsf-pf-null-wwe&ts=1615155679700&ref_url=https%253A%252F%252Fwww.mouser.com%252F>; DKPN: 296-25281-1-ND; MANUFACTURER: Texas Instruments; MOPN: 595-TPD2E007DCKR; MPN: TPD2E007DCKR
E_SELECT F_SELECT = HyTechDevices_Jumper:JUMPER_?_*: 2 Pin Connector; DKPN: 13-RC0603FR-130RLTR-ND; MANUFACTURER: YAGEO; MOPN: 603-RC0603FR-130RL; MPN: RC0603FR-130RL
J1 = HyTechDevices:CONNECTOR-4_?_*: 4 Pin Connector; DKPN: 2266-43045-0414-ND; MANUFACTURER: Molex; MOPN: 538-43045-0414; MPN: 430450414
K1-K3 = HyTechDevices:RELAY_DPDT_*: Dual Pole, Dual Throw Relay Datasheet <https://www.mouser.com/datasheet/2/418/5/NG_DS_RT2_1014-572844.pdf>; DKPN: PB969-ND; MANUFACTURER: TE Connectivity; MOPN: 655-RT424024; MPN: RT424024
LATCH = HyTechDevices:LED_?_*: LED 0603 Blue <https://www.mouser.com/datasheet/2/216/APT1608VBC_D-246010.pdf> Green <https://www.mouser.com/datasheet/2/216/APT1608ZGCK-1173388.pdf> Orange <https://www.mouser.com/datasheet/2/216/APT1608SECK-6197.pdf> Red <https://www.mouser.com/datasheet/2/216/APT1608SECK-J3-PRV-1173336.pdf> White <https://www.mouser.com/datasheet/2/50/SM0603UWC-880813.pdf> Yellow <https://www.mouser.com/datasheet/2/216/APT1608SYCK-J3-PRV-1173311.pdf> 2835 (Series not on Digikey) Lumiled LUXEON 2835 Color Line <https://www.mouser.com/datasheet/2/602/DS236_luxeon_2835_color_line_datasheet-1596094.pdf>; COLOR: White; DKPN: SM0603UWC-ND; MANUFACTURER: Bivar Inc.; MOPN: 749-SM0603UWC; MPN: SM0603UWC
LATCH_BUTTON = HyTechDevices:BUTTON: Button Datasheet <https://www.mouser.com/datasheet/2/307/en_b3s-1221332.pdf>; DKPN: SW415-ND; MANUFACTURER: Omron; MOPN: 653-B3S-1000; MPN: B3S-1000
MAIN_CONNECTOR = HyTechDevices - Copy:CONNECTOR-8_?_*: 8 Pin Connector; MANUFACTURER: MOLEX; MPN: 430450814
OKHS = HyTechDevices:LED_?_*: LED 0603 Blue <https://www.mouser.com/datasheet/2/216/APT1608VBC_D-246010.pdf> Green <https://www.mouser.com/datasheet/2/216/APT1608ZGCK-1173388.pdf> Orange <https://www.mouser.com/datasheet/2/216/APT1608SECK-6197.pdf> Red <https://www.mouser.com/datasheet/2/216/APT1608SECK-J3-PRV-1173336.pdf> White <https://www.mouser.com/datasheet/2/50/SM0603UWC-880813.pdf> Yellow <https://www.mouser.com/datasheet/2/216/APT1608SYCK-J3-PRV-1173311.pdf> 2835 (Series not on Digikey) Lumiled LUXEON 2835 Color Line <https://www.mouser.com/datasheet/2/602/DS236_luxeon_2835_color_line_datasheet-1596094.pdf>; COLOR: Yellow; DKPN: 754-1788-1-ND; MANUFACTURER: Kingbright; MOPN: 604-APT1608SYCK/J3-PRV; MPN: APT1608SYCK/J3-PRV
POWER SHDN_BTN = HyTechDevices:CONNECTOR-2_?_*: 2 Pin Connector; DKPN: WM12762-ND; MANUFACTURER: Molex; MOPN: 538-43650-0217; MPN: 436500217
R1 R9 R26 R31 = HyTechDevices:RESISTOR_?_*: Resistor PWR163 Series <https://www.mouser.com/datasheet/2/54/pwr163-777985.pdf> AC Series <https://www.mouser.com/datasheet/2/447/Yageo_PYu_AC_51_RoHS_L_7_1714230-1874691.pdf> PU Series <https://www.mouser.com/datasheet/2/447/PYu-PU_51_RoHS_L_6-1504619.pdf> UCR Series <https://fscdn.rohm.com/en/products/databook/datasheet/passive/resistor/chip_resistor/ucr-e.pdf> ERA Series <https://www.mouser.com/datasheet/2/315/AOA0000C307-1149632.pdf> PWR263 Series <https://www.mouser.com/datasheet/2/54/pwr263s_35-778069.pdf> KTR Series <https://www.mouser.com/datasheet/2/348/ROHM_S_A0011075115_1-2563276.pdf> RC Series <https://www.mouser.com/datasheet/2/447/Yageo_03_18_2021_PYu_RC_Group_51_RoHS_L_11-2199992.pdf> ERJ Low Resistance Series <https://www.mouser.com/datasheet/2/315/AOA0000C313-1141758.pdf> ERJ PB3, PB6 Series <https://www.mouser.com/datasheet/2/315/AOA0000C328-1530132.pdf> ERJ UP3, UP6, UP8 Series <https://www.mouser.com/datasheet/2/315/Panasonic_Resistors_Thick_Film_Anti_Sulf_Anti_Surg-1825099.pdf> ERJ PA2, P03, PA3, P06, P08, P14 Series <https://www.mouser.com/datasheet/2/315/AOA0000C331-1141874.pdf> B20 Series <https://www.ohmite.com/assets/docs/res_200.pdf?r=false> TE Connectivity/Holsworthy RN73 Series <https://www.mouser.com/datasheet/2/418/4/NG_DS_1773270_M-604713.pdf> Vishay Dale D/CRCW e3 <https://www.mouser.com/datasheet/2/427/dcrcwe3-1762152.pdf> Ohmite B20 <https://www.ohmite.com/assets/docs/res_200.pdf?r=false>; DKPN: P470BYCT-ND; MANUFACTURER: Panasonic Electronic Components; MOPN: 667-ERJ-PA3F4700V; MPN: ERJ-PA3F4700V; POWER: 0.25W; RESISTANCE: 470; TOLERANCE: 1%; VOLTAGE_CONTINUOUS: 10.84V; VOLTAGE_MAX: 150V
R2-R8 R38 = HyTechDevices:RESISTOR_?_*: Resistor PWR163 Series <https://www.mouser.com/datasheet/2/54/pwr163-777985.pdf> AC Series <https://www.mouser.com/datasheet/2/447/Yageo_PYu_AC_51_RoHS_L_7_1714230-1874691.pdf> PU Series <https://www.mouser.com/datasheet/2/447/PYu-PU_51_RoHS_L_6-1504619.pdf> UCR Series <https://fscdn.rohm.com/en/products/databook/datasheet/passive/resistor/chip_resistor/ucr-e.pdf> ERA Series <https://www.mouser.com/datasheet/2/315/AOA0000C307-1149632.pdf> PWR263 Series <https://www.mouser.com/datasheet/2/54/pwr263s_35-778069.pdf> KTR Series <https://www.mouser.com/datasheet/2/348/ROHM_S_A0011075115_1-2563276.pdf> RC Series <https://www.mouser.com/datasheet/2/447/Yageo_03_18_2021_PYu_RC_Group_51_RoHS_L_11-2199992.pdf> ERJ Low Resistance Series <https://www.mouser.com/datasheet/2/315/AOA0000C313-1141758.pdf> ERJ PB3, PB6 Series <https://www.mouser.com/datasheet/2/315/AOA0000C328-1530132.pdf> ERJ UP3, UP6, UP8 Series <https://www.mouser.com/datasheet/2/315/Panasonic_Resistors_Thick_Film_Anti_Sulf_Anti_Surg-1825099.pdf> ERJ PA2, P03, PA3, P06, P08, P14 Series <https://www.mouser.com/datasheet/2/315/AOA0000C331-1141874.pdf> B20 Series <https://www.ohmite.com/assets/docs/res_200.pdf?r=false> TE Connectivity/Holsworthy RN73 Series <https://www.mouser.com/datasheet/2/418/4/NG_DS_1773270_M-604713.pdf> Vishay Dale D/CRCW e3 <https://www.mouser.com/datasheet/2/427/dcrcwe3-1762152.pdf> Ohmite B20 <https://www.ohmite.com/assets/docs/res_200.pdf?r=false>; DKPN: 10-ERJ-UP3F2001VTR-ND; MANUFACTURER: Panasonic Electronic Components; MOPN: 667-ERJ-UP3F2001V; MPN: ERJ-UP3F2001V; POWER: 0.25W; RESISTANCE: 2k; TOLERANCE: 1%; VOLTAGE_CONTINUOUS: 22.36V; VOLTAGE_MAX: 150V
R10-R16 = HyTechDevices:RESISTOR_?_*: Resistor PWR163 Series <https://www.mouser.com/datasheet/2/54/pwr163-777985.pdf> AC Series <https://www.mouser.com/datasheet/2/447/Yageo_PYu_AC_51_RoHS_L_7_1714230-1874691.pdf> PU Series <https://www.mouser.com/datasheet/2/447/PYu-PU_51_RoHS_L_6-1504619.pdf> UCR Series <https://fscdn.rohm.com/en/products/databook/datasheet/passive/resistor/chip_resistor/ucr-e.pdf> ERA Series <https://www.mouser.com/datasheet/2/315/AOA0000C307-1149632.pdf> PWR263 Series <https://www.mouser.com/datasheet/2/54/pwr263s_35-778069.pdf> KTR Series <https://www.mouser.com/datasheet/2/348/ROHM_S_A0011075115_1-2563276.pdf> RC Series <https://www.mouser.com/datasheet/2/447/Yageo_03_18_2021_PYu_RC_Group_51_RoHS_L_11-2199992.pdf> ERJ Low Resistance Series <https://www.mouser.com/datasheet/2/315/AOA0000C313-1141758.pdf> ERJ PB3, PB6 Series <https://www.mouser.com/datasheet/2/315/AOA0000C328-1530132.pdf> ERJ UP3, UP6, UP8 Series <https://www.mouser.com/datasheet/2/315/Panasonic_Resistors_Thick_Film_Anti_Sulf_Anti_Surg-1825099.pdf> ERJ PA2, P03, PA3, P06, P08, P14 Series <https://www.mouser.com/datasheet/2/315/AOA0000C331-1141874.pdf> B20 Series <https://www.ohmite.com/assets/docs/res_200.pdf?r=false> TE Connectivity/Holsworthy RN73 Series <https://www.mouser.com/datasheet/2/418/4/NG_DS_1773270_M-604713.pdf> Vishay Dale D/CRCW e3 <https://www.mouser.com/datasheet/2/427/dcrcwe3-1762152.pdf> Ohmite B20 <https://www.ohmite.com/assets/docs/res_200.pdf?r=false>; DKPN: 311-5.10KHRTR-ND; MANUFACTURER: Yageo; MOPN: 603-RC0603FR-075K1L; MPN: RC0603FR-075K1L; POWER: 0.1W; RESISTANCE: 5.1k; TOLERANCE: 1%; VOLTAGE_CONTINUOUS: 22.58V; VOLTAGE_MAX: 75V
R17-R23 = HyTechDevices:RESISTOR_?_*: Resistor PWR163 Series <https://www.mouser.com/datasheet/2/54/pwr163-777985.pdf> AC Series <https://www.mouser.com/datasheet/2/447/Yageo_PYu_AC_51_RoHS_L_7_1714230-1874691.pdf> PU Series <https://www.mouser.com/datasheet/2/447/PYu-PU_51_RoHS_L_6-1504619.pdf> UCR Series <https://fscdn.rohm.com/en/products/databook/datasheet/passive/resistor/chip_resistor/ucr-e.pdf> ERA Series <https://www.mouser.com/datasheet/2/315/AOA0000C307-1149632.pdf> PWR263 Series <https://www.mouser.com/datasheet/2/54/pwr263s_35-778069.pdf> KTR Series <https://www.mouser.com/datasheet/2/348/ROHM_S_A0011075115_1-2563276.pdf> RC Series <https://www.mouser.com/datasheet/2/447/Yageo_03_18_2021_PYu_RC_Group_51_RoHS_L_11-2199992.pdf> ERJ Low Resistance Series <https://www.mouser.com/datasheet/2/315/AOA0000C313-1141758.pdf> ERJ PB3, PB6 Series <https://www.mouser.com/datasheet/2/315/AOA0000C328-1530132.pdf> ERJ UP3, UP6, UP8 Series <https://www.mouser.com/datasheet/2/315/Panasonic_Resistors_Thick_Film_Anti_Sulf_Anti_Surg-1825099.pdf> ERJ PA2, P03, PA3, P06, P08, P14 Series <https://www.mouser.com/datasheet/2/315/AOA0000C331-1141874.pdf> B20 Series <https://www.ohmite.com/assets/docs/res_200.pdf?r=false> TE Connectivity/Holsworthy RN73 Series <https://www.mouser.com/datasheet/2/418/4/NG_DS_1773270_M-604713.pdf> Vishay Dale D/CRCW e3 <https://www.mouser.com/datasheet/2/427/dcrcwe3-1762152.pdf> Ohmite B20 <https://www.ohmite.com/assets/docs/res_200.pdf?r=false>; DKPN: RHM33KAYTR-ND; MANUFACTURER: Rohm Semiconductor; MOPN: 755-KTR03EZPF3302; MPN: KTR03EZPF3302; POWER: 0.1W; RESISTANCE: 33k; TOLERANCE: 1%; VOLTAGE_CONTINUOUS: 57.44V; VOLTAGE_MAX: 350V
R24 = HyTechDevices:RESISTOR_?_*: Resistor PWR163 Series <https://www.mouser.com/datasheet/2/54/pwr163-777985.pdf> AC Series <https://www.mouser.com/datasheet/2/447/Yageo_PYu_AC_51_RoHS_L_7_1714230-1874691.pdf> PU Series <https://www.mouser.com/datasheet/2/447/PYu-PU_51_RoHS_L_6-1504619.pdf> UCR Series <https://fscdn.rohm.com/en/products/databook/datasheet/passive/resistor/chip_resistor/ucr-e.pdf> ERA Series <https://www.mouser.com/datasheet/2/315/AOA0000C307-1149632.pdf> PWR263 Series <https://www.mouser.com/datasheet/2/54/pwr263s_35-778069.pdf> KTR Series <https://www.mouser.com/datasheet/2/348/ROHM_S_A0011075115_1-2563276.pdf> RC Series <https://www.mouser.com/datasheet/2/447/Yageo_03_18_2021_PYu_RC_Group_51_RoHS_L_11-2199992.pdf> ERJ Low Resistance Series <https://www.mouser.com/datasheet/2/315/AOA0000C313-1141758.pdf> ERJ PB3, PB6 Series <https://www.mouser.com/datasheet/2/315/AOA0000C328-1530132.pdf> ERJ UP3, UP6, UP8 Series <https://www.mouser.com/datasheet/2/315/Panasonic_Resistors_Thick_Film_Anti_Sulf_Anti_Surg-1825099.pdf> ERJ PA2, P03, PA3, P06, P08, P14 Series <https://www.mouser.com/datasheet/2/315/AOA0000C331-1141874.pdf> B20 Series <https://www.ohmite.com/assets/docs/res_200.pdf?r=false> TE Connectivity/Holsworthy RN73 Series <https://www.mouser.com/datasheet/2/418/4/NG_DS_1773270_M-604713.pdf> Vishay Dale D/CRCW e3 <https://www.mouser.com/datasheet/2/427/dcrcwe3-1762152.pdf> Ohmite B20 <https://www.ohmite.com/assets/docs/res_200.pdf?r=false>; DKPN: P1.33KDBCT-ND; MANUFACTURER: Panasonic Electronic Components; MOPN: 667-ERA-3AEB1331V; MPN: ERA-3AEB1331V; POWER: 0.1W; RESISTANCE: 1.33k; TOLERANCE: 0.1%; VOLTAGE_CONTINUOUS: 11.53V; VOLTAGE_MAX: 75V
R25 R34 R37 = HyTechDevices:RESISTOR_?_*: Resistor PWR163 Series <https://www.mouser.com/datasheet/2/54/pwr163-777985.pdf> AC Series <https://www.mouser.com/datasheet/2/447/Yageo_PYu_AC_51_RoHS_L_7_1714230-1874691.pdf> PU Series <https://www.mouser.com/datasheet/2/447/PYu-PU_51_RoHS_L_6-1504619.pdf> UCR Series <https://fscdn.rohm.com/en/products/databook/datasheet/passive/resistor/chip_resistor/ucr-e.pdf> ERA Series <https://www.mouser.com/datasheet/2/315/AOA0000C307-1149632.pdf> PWR263 Series <https://www.mouser.com/datasheet/2/54/pwr263s_35-778069.pdf> KTR Series <https://www.mouser.com/datasheet/2/348/ROHM_S_A0011075115_1-2563276.pdf> RC Series <https://www.mouser.com/datasheet/2/447/Yageo_03_18_2021_PYu_RC_Group_51_RoHS_L_11-2199992.pdf> ERJ Low Resistance Series <https://www.mouser.com/datasheet/2/315/AOA0000C313-1141758.pdf> ERJ PB3, PB6 Series <https://www.mouser.com/datasheet/2/315/AOA0000C328-1530132.pdf> ERJ UP3, UP6, UP8 Series <https://www.mouser.com/datasheet/2/315/Panasonic_Resistors_Thick_Film_Anti_Sulf_Anti_Surg-1825099.pdf> ERJ PA2, P03, PA3, P06, P08, P14 Series <https://www.mouser.com/datasheet/2/315/AOA0000C331-1141874.pdf> B20 Series <https://www.ohmite.com/assets/docs/res_200.pdf?r=false> TE Connectivity/Holsworthy RN73 Series <https://www.mouser.com/datasheet/2/418/4/NG_DS_1773270_M-604713.pdf> Vishay Dale D/CRCW e3 <https://www.mouser.com/datasheet/2/427/dcrcwe3-1762152.pdf> Ohmite B20 <https://www.ohmite.com/assets/docs/res_200.pdf?r=false>; DKPN: 311-22.0HRCT-ND; MANUFACTURER: Yageo; MOPN: 603-RC0603FR-0722RL; MPN: RC0603FR-0722RL; POWER: 0.1W; RESISTANCE: 22; TOLERANCE: 1%; VOLTAGE_CONTINUOUS: 1.48V; VOLTAGE_MAX: 75V
R27 = HyTechDevices:RESISTOR_?_*: Resistor PWR163 Series <https://www.mouser.com/datasheet/2/54/pwr163-777985.pdf> AC Series <https://www.mouser.com/datasheet/2/447/Yageo_PYu_AC_51_RoHS_L_7_1714230-1874691.pdf> PU Series <https://www.mouser.com/datasheet/2/447/PYu-PU_51_RoHS_L_6-1504619.pdf> UCR Series <https://fscdn.rohm.com/en/products/databook/datasheet/passive/resistor/chip_resistor/ucr-e.pdf> ERA Series <https://www.mouser.com/datasheet/2/315/AOA0000C307-1149632.pdf> PWR263 Series <https://www.mouser.com/datasheet/2/54/pwr263s_35-778069.pdf> KTR Series <https://www.mouser.com/datasheet/2/348/ROHM_S_A0011075115_1-2563276.pdf> RC Series <https://www.mouser.com/datasheet/2/447/Yageo_03_18_2021_PYu_RC_Group_51_RoHS_L_11-2199992.pdf> ERJ Low Resistance Series <https://www.mouser.com/datasheet/2/315/AOA0000C313-1141758.pdf> ERJ PB3, PB6 Series <https://www.mouser.com/datasheet/2/315/AOA0000C328-1530132.pdf> ERJ UP3, UP6, UP8 Series <https://www.mouser.com/datasheet/2/315/Panasonic_Resistors_Thick_Film_Anti_Sulf_Anti_Surg-1825099.pdf> ERJ PA2, P03, PA3, P06, P08, P14 Series <https://www.mouser.com/datasheet/2/315/AOA0000C331-1141874.pdf> B20 Series <https://www.ohmite.com/assets/docs/res_200.pdf?r=false> TE Connectivity/Holsworthy RN73 Series <https://www.mouser.com/datasheet/2/418/4/NG_DS_1773270_M-604713.pdf> Vishay Dale D/CRCW e3 <https://www.mouser.com/datasheet/2/427/dcrcwe3-1762152.pdf> Ohmite B20 <https://www.ohmite.com/assets/docs/res_200.pdf?r=false>; DKPN: 311-100KHRTR-ND; MANUFACTURER: Yageo; MOPN: 603-RC0603FR-07100KL; MPN: RC0603FR-07100KL; POWER: 0.1W; RESISTANCE: 100k; TOLERANCE: 1%; VOLTAGE_CONTINUOUS: 75V; VOLTAGE_MAX: 75V
R28-R30 = HyTechDevices:RESISTOR_?_*: Resistor PWR163 Series <https://www.mouser.com/datasheet/2/54/pwr163-777985.pdf> AC Series <https://www.mouser.com/datasheet/2/447/Yageo_PYu_AC_51_RoHS_L_7_1714230-1874691.pdf> PU Series <https://www.mouser.com/datasheet/2/447/PYu-PU_51_RoHS_L_6-1504619.pdf> UCR Series <https://fscdn.rohm.com/en/products/databook/datasheet/passive/resistor/chip_resistor/ucr-e.pdf> ERA Series <https://www.mouser.com/datasheet/2/315/AOA0000C307-1149632.pdf> PWR263 Series <https://www.mouser.com/datasheet/2/54/pwr263s_35-778069.pdf> KTR Series <https://www.mouser.com/datasheet/2/348/ROHM_S_A0011075115_1-2563276.pdf> RC Series <https://www.mouser.com/datasheet/2/447/Yageo_03_18_2021_PYu_RC_Group_51_RoHS_L_11-2199992.pdf> ERJ Low Resistance Series <https://www.mouser.com/datasheet/2/315/AOA0000C313-1141758.pdf> ERJ PB3, PB6 Series <https://www.mouser.com/datasheet/2/315/AOA0000C328-1530132.pdf> ERJ UP3, UP6, UP8 Series <https://www.mouser.com/datasheet/2/315/Panasonic_Resistors_Thick_Film_Anti_Sulf_Anti_Surg-1825099.pdf> ERJ PA2, P03, PA3, P06, P08, P14 Series <https://www.mouser.com/datasheet/2/315/AOA0000C331-1141874.pdf> B20 Series <https://www.ohmite.com/assets/docs/res_200.pdf?r=false> TE Connectivity/Holsworthy RN73 Series <https://www.mouser.com/datasheet/2/418/4/NG_DS_1773270_M-604713.pdf> Vishay Dale D/CRCW e3 <https://www.mouser.com/datasheet/2/427/dcrcwe3-1762152.pdf> Ohmite B20 <https://www.ohmite.com/assets/docs/res_200.pdf?r=false>; DKPN: P10KBDCT-ND; MANUFACTURER: Panasonic Electronic Components; MOPN: 667-ERA-3ARB103V; MPN: ERA-3ARB103V; POWER: 0.1W; RESISTANCE: 10k; TOLERANCE: 0.1%; VOLTAGE_CONTINUOUS: 31.62V; VOLTAGE_MAX: 75V
R32 R35 = HyTechDevices:RESISTOR_?_*: Resistor PWR163 Series <https://www.mouser.com/datasheet/2/54/pwr163-777985.pdf> AC Series <https://www.mouser.com/datasheet/2/447/Yageo_PYu_AC_51_RoHS_L_7_1714230-1874691.pdf> PU Series <https://www.mouser.com/datasheet/2/447/PYu-PU_51_RoHS_L_6-1504619.pdf> UCR Series <https://fscdn.rohm.com/en/products/databook/datasheet/passive/resistor/chip_resistor/ucr-e.pdf> ERA Series <https://www.mouser.com/datasheet/2/315/AOA0000C307-1149632.pdf> PWR263 Series <https://www.mouser.com/datasheet/2/54/pwr263s_35-778069.pdf> KTR Series <https://www.mouser.com/datasheet/2/348/ROHM_S_A0011075115_1-2563276.pdf> RC Series <https://www.mouser.com/datasheet/2/447/Yageo_03_18_2021_PYu_RC_Group_51_RoHS_L_11-2199992.pdf> ERJ Low Resistance Series <https://www.mouser.com/datasheet/2/315/AOA0000C313-1141758.pdf> ERJ PB3, PB6 Series <https://www.mouser.com/datasheet/2/315/AOA0000C328-1530132.pdf> ERJ UP3, UP6, UP8 Series <https://www.mouser.com/datasheet/2/315/Panasonic_Resistors_Thick_Film_Anti_Sulf_Anti_Surg-1825099.pdf> ERJ PA2, P03, PA3, P06, P08, P14 Series <https://www.mouser.com/datasheet/2/315/AOA0000C331-1141874.pdf> B20 Series <https://www.ohmite.com/assets/docs/res_200.pdf?r=false> TE Connectivity/Holsworthy RN73 Series <https://www.mouser.com/datasheet/2/418/4/NG_DS_1773270_M-604713.pdf> Vishay Dale D/CRCW e3 <https://www.mouser.com/datasheet/2/427/dcrcwe3-1762152.pdf> Ohmite B20 <https://www.ohmite.com/assets/docs/res_200.pdf?r=false>; DKPN: 1712-CPF-A-0603B1K0ETR-ND; MANUFACTURER: TE Connectivity Passive Product; MOPN: 279-CPF-A-0603B1K0E; MPN: CPF-A-0603B1K0E; POWER: 0.0625W; RESISTANCE: 1k; TOLERANCE: 0.1%; VOLTAGE_CONTINUOUS: 7.9V; VOLTAGE_MAX: 50V
R33 = HyTechDevices:RESISTOR_?_*: Resistor PWR163 Series <https://www.mouser.com/datasheet/2/54/pwr163-777985.pdf> AC Series <https://www.mouser.com/datasheet/2/447/Yageo_PYu_AC_51_RoHS_L_7_1714230-1874691.pdf> PU Series <https://www.mouser.com/datasheet/2/447/PYu-PU_51_RoHS_L_6-1504619.pdf> UCR Series <https://fscdn.rohm.com/en/products/databook/datasheet/passive/resistor/chip_resistor/ucr-e.pdf> ERA Series <https://www.mouser.com/datasheet/2/315/AOA0000C307-1149632.pdf> PWR263 Series <https://www.mouser.com/datasheet/2/54/pwr263s_35-778069.pdf> KTR Series <https://www.mouser.com/datasheet/2/348/ROHM_S_A0011075115_1-2563276.pdf> RC Series <https://www.mouser.com/datasheet/2/447/Yageo_03_18_2021_PYu_RC_Group_51_RoHS_L_11-2199992.pdf> ERJ Low Resistance Series <https://www.mouser.com/datasheet/2/315/AOA0000C313-1141758.pdf> ERJ PB3, PB6 Series <https://www.mouser.com/datasheet/2/315/AOA0000C328-1530132.pdf> ERJ UP3, UP6, UP8 Series <https://www.mouser.com/datasheet/2/315/Panasonic_Resistors_Thick_Film_Anti_Sulf_Anti_Surg-1825099.pdf> ERJ PA2, P03, PA3, P06, P08, P14 Series <https://www.mouser.com/datasheet/2/315/AOA0000C331-1141874.pdf> B20 Series <https://www.ohmite.com/assets/docs/res_200.pdf?r=false> TE Connectivity/Holsworthy RN73 Series <https://www.mouser.com/datasheet/2/418/4/NG_DS_1773270_M-604713.pdf> Vishay Dale D/CRCW e3 <https://www.mouser.com/datasheet/2/427/dcrcwe3-1762152.pdf> Ohmite B20 <https://www.ohmite.com/assets/docs/res_200.pdf?r=false>; DKPN: P20020CT-ND; MANUFACTURER: Panasonic Electronic Components; MOPN: 667-ERJ-PB3B2741V; MPN: ERJ-PB3B2741V; POWER: 0.2W; RESISTANCE: 2.74k; TOLERANCE: 0.1%; VOLTAGE_CONTINUOUS: 23.41V; VOLTAGE_MAX: 150V
R39 R40 = HyTechDevices:RESISTOR_?_*: Resistor PWR163 Series <https://www.mouser.com/datasheet/2/54/pwr163-777985.pdf> AC Series <https://www.mouser.com/datasheet/2/447/Yageo_PYu_AC_51_RoHS_L_7_1714230-1874691.pdf> PU Series <https://www.mouser.com/datasheet/2/447/PYu-PU_51_RoHS_L_6-1504619.pdf> UCR Series <https://fscdn.rohm.com/en/products/databook/datasheet/passive/resistor/chip_resistor/ucr-e.pdf> ERA Series <https://www.mouser.com/datasheet/2/315/AOA0000C307-1149632.pdf> PWR263 Series <https://www.mouser.com/datasheet/2/54/pwr263s_35-778069.pdf> KTR Series <https://www.mouser.com/datasheet/2/348/ROHM_S_A0011075115_1-2563276.pdf> RC Series <https://www.mouser.com/datasheet/2/447/Yageo_03_18_2021_PYu_RC_Group_51_RoHS_L_11-2199992.pdf> ERJ Low Resistance Series <https://www.mouser.com/datasheet/2/315/AOA0000C313-1141758.pdf> ERJ PB3, PB6 Series <https://www.mouser.com/datasheet/2/315/AOA0000C328-1530132.pdf> ERJ UP3, UP6, UP8 Series <https://www.mouser.com/datasheet/2/315/Panasonic_Resistors_Thick_Film_Anti_Sulf_Anti_Surg-1825099.pdf> ERJ PA2, P03, PA3, P06, P08, P14 Series <https://www.mouser.com/datasheet/2/315/AOA0000C331-1141874.pdf> B20 Series <https://www.ohmite.com/assets/docs/res_200.pdf?r=false> TE Connectivity/Holsworthy RN73 Series <https://www.mouser.com/datasheet/2/418/4/NG_DS_1773270_M-604713.pdf> Vishay Dale D/CRCW e3 <https://www.mouser.com/datasheet/2/427/dcrcwe3-1762152.pdf> Ohmite B20 <https://www.ohmite.com/assets/docs/res_200.pdf?r=false>; DKPN: 311-60.4HRCT-ND; MANUFACTURER: Yageo; MOPN: 603-RC0603FR-0760R4L; MPN: RC0603FR-0760R4L; POWER: 0.1W; RESISTANCE: 60.4; TOLERANCE: 1%; VOLTAGE_CONTINUOUS: 2.48V; VOLTAGE_MAX: 75V
R100 = HyTechDevices:RESISTOR_?_*: Resistor PWR163 Series <https://www.mouser.com/datasheet/2/54/pwr163-777985.pdf> AC Series <https://www.mouser.com/datasheet/2/447/Yageo_PYu_AC_51_RoHS_L_7_1714230-1874691.pdf> PU Series <https://www.mouser.com/datasheet/2/447/PYu-PU_51_RoHS_L_6-1504619.pdf> UCR Series <https://fscdn.rohm.com/en/products/databook/datasheet/passive/resistor/chip_resistor/ucr-e.pdf> ERA Series <https://www.mouser.com/datasheet/2/315/AOA0000C307-1149632.pdf> PWR263 Series <https://www.mouser.com/datasheet/2/54/pwr263s_35-778069.pdf> KTR Series <https://www.mouser.com/datasheet/2/348/ROHM_S_A0011075115_1-2563276.pdf> RC Series <https://www.mouser.com/datasheet/2/447/Yageo_03_18_2021_PYu_RC_Group_51_RoHS_L_11-2199992.pdf> ERJ Low Resistance Series <https://www.mouser.com/datasheet/2/315/AOA0000C313-1141758.pdf> ERJ PB3, PB6 Series <https://www.mouser.com/datasheet/2/315/AOA0000C328-1530132.pdf> ERJ UP3, UP6, UP8 Series <https://www.mouser.com/datasheet/2/315/Panasonic_Resistors_Thick_Film_Anti_Sulf_Anti_Surg-1825099.pdf> ERJ PA2, P03, PA3, P06, P08, P14 Series <https://www.mouser.com/datasheet/2/315/AOA0000C331-1141874.pdf> B20 Series <https://www.ohmite.com/assets/docs/res_200.pdf?r=false> TE Connectivity/Holsworthy RN73 Series <https://www.mouser.com/datasheet/2/418/4/NG_DS_1773270_M-604713.pdf> Vishay Dale D/CRCW e3 <https://www.mouser.com/datasheet/2/427/dcrcwe3-1762152.pdf> Ohmite B20 <https://www.ohmite.com/assets/docs/res_200.pdf?r=false>; DKPN: P5.9KDBCT-ND; MANUFACTURER: Panasonic Electronic Components; MOPN: 667-ERA-3AEB5901V; MPN: ERA-3AEB5901V; POWER: 0.1W; RESISTANCE: 5.9k; TOLERANCE: 0.1%; VOLTAGE_CONTINUOUS: 24.29V; VOLTAGE_MAX: 75V
SHDN_B SHDN_C SHDN_D SHDN_E SHDN_F = HyTechDevices:LED_?_*: LED 0603 Blue <https://www.mouser.com/datasheet/2/216/APT1608VBC_D-246010.pdf> Green <https://www.mouser.com/datasheet/2/216/APT1608ZGCK-1173388.pdf> Orange <https://www.mouser.com/datasheet/2/216/APT1608SECK-6197.pdf> Red <https://www.mouser.com/datasheet/2/216/APT1608SECK-J3-PRV-1173336.pdf> White <https://www.mouser.com/datasheet/2/50/SM0603UWC-880813.pdf> Yellow <https://www.mouser.com/datasheet/2/216/APT1608SYCK-J3-PRV-1173311.pdf> 2835 (Series not on Digikey) Lumiled LUXEON 2835 Color Line <https://www.mouser.com/datasheet/2/602/DS236_luxeon_2835_color_line_datasheet-1596094.pdf>; COLOR: Orange; DKPN: 754-1120-1-ND; MANUFACTURER: Kingbright; MOPN: 604-APT1608SECK; MPN: APT1608SECK
TP1 = HyTechDevices:TEST_POINT: Test Point for Probing; DKPN: 36-5015CT-ND; MANUFACTURER: Keystone Electronics; MOPN: 534-5015; MPN: 5015; SIGNAL: GND
TP2 = HyTechDevices:TEST_POINT: Test Point for Probing; DKPN: 36-5015CT-ND; MANUFACTURER: Keystone Electronics; MOPN: 534-5015; MPN: 5015; SIGNAL: SHDN_B
TP3 = HyTechDevices:TEST_POINT: Test Point for Probing; DKPN: 36-5015CT-ND; MANUFACTURER: Keystone Electronics; MOPN: 534-5015; MPN: 5015; SIGNAL: SHDN_C
TP4 = HyTechDevices:TEST_POINT: Test Point for Probing; DKPN: 36-5015CT-ND; MANUFACTURER: Keystone Electronics; MOPN: 534-5015; MPN: 5015; SIGNAL: SHDN_D
TP5 = HyTechDevices:TEST_POINT: Test Point for Probing; DKPN: 36-5015CT-ND; MANUFACTURER: Keystone Electronics; MOPN: 534-5015; MPN: 5015; SIGNAL: SHDN_E
TP6 = HyTechDevices:TEST_POINT: Test Point for Probing; DKPN: 36-5015CT-ND; MANUFACTURER: Keystone Electronics; MOPN: 534-5015; MPN: 5015; SIGNAL: SHDN_F
TP7 = HyTechDevices:TEST_POINT: Test Point for Probing; DKPN: 36-5015CT-ND; MANUFACTURER: Keystone Electronics; MOPN: 534-5015; MPN: 5015; SIGNAL: BMS_OK
TP8 = HyTechDevices:TEST_POINT: Test Point for Probing; DKPN: 36-5015CT-ND; MANUFACTURER: Keystone Electronics; MOPN: 534-5015; MPN: 5015; SIGNAL: IMD_OK
TP9 = HyTechDevices:TEST_POINT: Test Point for Probing; DKPN: 36-5015CT-ND; MANUFACTURER: Keystone Electronics; MOPN: 534-5015; MPN: 5015; SIGNAL: CCU_OK
TP10 = HyTechDevices:TEST_POINT: Test Point for Probing; DKPN: 36-5015CT-ND; MANUFACTURER: Keystone Electronics; MOPN: 534-5015; MPN: 5015; SIGNAL: SHDN_A
TP11 = HyTechDevices:TEST_POINT: Test Point for Probing; DKPN: 36-5015CT-ND; MANUFACTURER: Keystone Electronics; MOPN: 534-5015; MPN: 5015; SIGNAL: +3V3
TP12 = HyTechDevices:TEST_POINT: Test Point for Probing; DKPN: 36-5015CT-ND; MANUFACTURER: Keystone Electronics; MOPN: 534-5015; MPN: 5015; SIGNAL: +5V
TP13 = HyTechDevices:TEST_POINT: Test Point for Probing; DKPN: 36-5015CT-ND; MANUFACTURER: Keystone Electronics; MOPN: 534-5015; MPN: 5015; SIGNAL: +12V
U1 = HyTechDevices:LOGICGATE_BUFFER: Buffer SN74LVC Datasheet <https://www.ti.com/lit/ds/symlink/sn74lvc1g34.pdf>; DKPN: 296-26604-2-ND; MANUFACTURER: Texas Instruments; MOPN: 595-SN74LVC1G34DCKT; MPN: SN74LVC1G34DCKT
U2 = HyTechDevices:ADM8316: ADM8316 Watchdog Datasheet <https://www.mouser.com/datasheet/2/609/adm8316_8318_8319_8320_8321_8322-1503275.pdf>; DKPN: ADM8316WBX30ARJZR7TR-ND; MANUFACTURER: Analog Devices Inc.; MOPN: 584-M8316WBX30ARJZR7; MPN: ADM8316WBX30ARJZR7; RESET_VOLTAGE: 3V; TIMEOUT: 102ms
U3 = HyTechDevices:VOLTAGE_REGULATOR_MODULE_?_*: Voltage Regulator Modules OKI-78SR Datasheet <https://www.mouser.com/datasheet/2/281/oki-78sr-56393.pdf>; DKPN: 811-2196-5-ND; MANUFACTURER: Murata Power Solutions Inc.; MOPN: 580-OKI78SR5/1.5W36C; MPN: OKI-78SR-5/1.5-W36-C
U4 U5 = HyTechDevices:TCAN1051*V-Q1: TCAN1051*V Can Tranciever Datasheet <https://www.ti.com/lit/ds/symlink/tcan1051hgv-q1.pdf?HQS=dis-mous-null-mousermode-dsf-pf-null-wwe&ts=1610765132518&ref_url=https%253A%252F%252Fwww.mouser.com%252Ff>; DKPN: 296-49935-1-ND; MANUFACTURER: Texas Instruments; MOPN: 595-TCAN1051HGVDQ1; MPN: TCAN1051HGVDRQ1
U$4 = HyTechDevices:RELAY_SOLIDSTATE_NO: AQY214EH Normally Open Solid State Relay Datasheet <https://www.datasheetq.com/datasheet-download/287654/1/Panasonic/AQY214EH>; DKPN: 255-1436-5-ND; MANUFACTURER: AQY214EHA; MOPN: 769-AQY214EHA; MPN: AQY214EHA
U$100 = HyTechDevices:RELAY_SOLIDSTATE_NO_*: AQY214EHA Normally Open Solid State Relay Datasheet <https://www.datasheetq.com/datasheet-download/287654/1/Panasonic/AQY214EH> Crydom CMX Series Solid State Normally Open Relay Datasheet <https://www.mouser.com/datasheet/2/657/cmx_series_dc_pcb_mount-1370813.pdf> AB38S-Q Datasheet <https://comus-intl.com/wp-content/uploads/2016/09/AB38S-Q.pdf> CPC1020NTR Datasheet <https://www.mouser.com/datasheet/2/240/CPC1020N-1546163.pdf>; DKPN: 255-1436-5-ND; MANUFACTURER: Panasonic; MOPN: 769-AQY214EHA; MPN: AQY214EHA
XB1 = HyTechDevices:BATTERY_HOLDER_*: Keystone 498 1/3N Cell Holder PN for the holder; if 1/3N batteries needed, order separately. Datasheet <https://www.mouser.com/datasheet/2/215/98-745913.pdf>; BATTERY_TYPE: 1/3N; DKPN: 36-498-ND; MANUFACTURER: Keystone Electronics; MOPN: 534-498; MPN: 498
XF1 XF2 = HyTechDevices:FUSE_HOLDER_*: Fuse Holder All PNs for the holder; if Miniblade Fuses <https://www.littelfuse.com/media?resourcetype=datasheets&itemid=0f5f58cb-559e-494b-8d53-723f30445ae5&filename=littelfuse-mini-datasheet> needed, order separately. Mini-Blade PTH <https://www.mouser.com/datasheet/2/215/3568-742601.pdf> Mini-Blade SMD <https://www.mouser.com/datasheet/2/215/588-744913.pdf> Littelfuse 122 Fuse Holder and Fuse Fuse <https://www.littelfuse.com/~/media/electronics/datasheets/fuses/littelfuse_fuse_508_datasheet.pdf.pdf> Fuse Holder <https://www.littelfuse.com/~/media/electronics/datasheets/fuse_clips/littelfuse_fuse_clip_102_122_datasheet.pdf.pdf>; DKPN: 36-3568-ND; FUSE_TYPE: MINI 297; MANUFACTURER: Keystone; MOPN: 534-3568; MPN: 3568

## Board
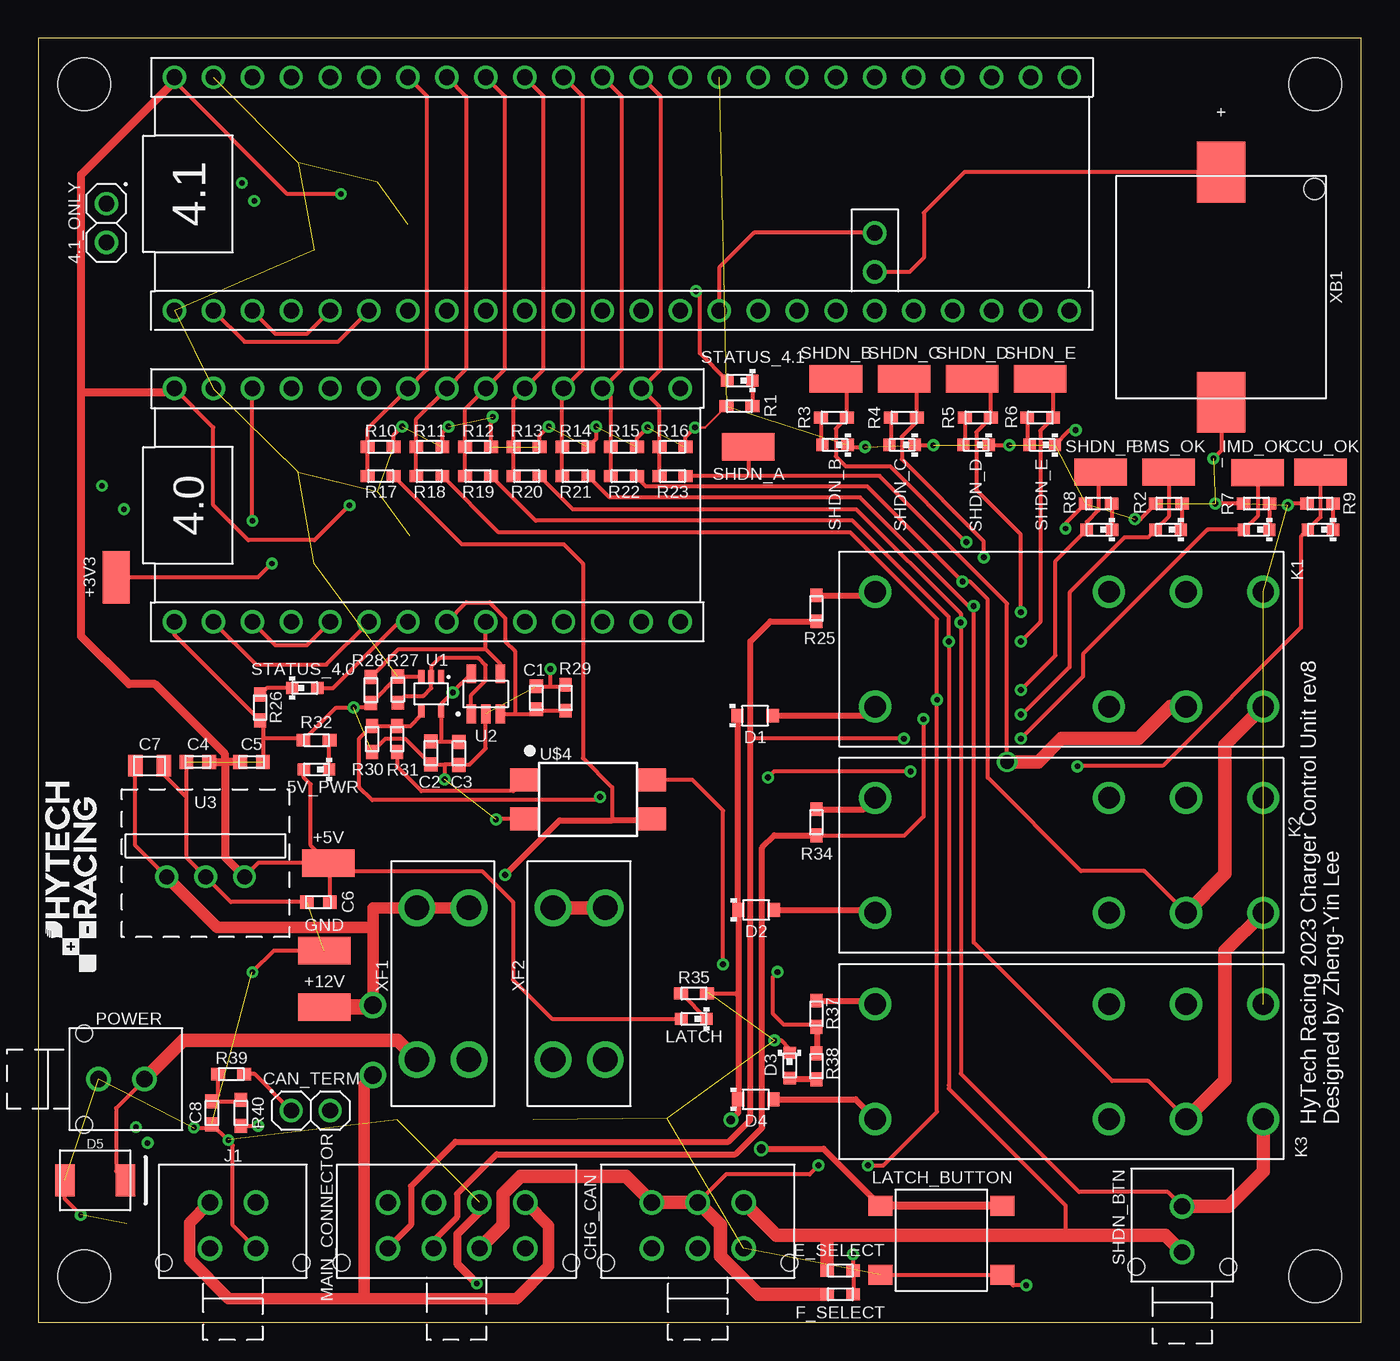
[diagram p4: board, top side]
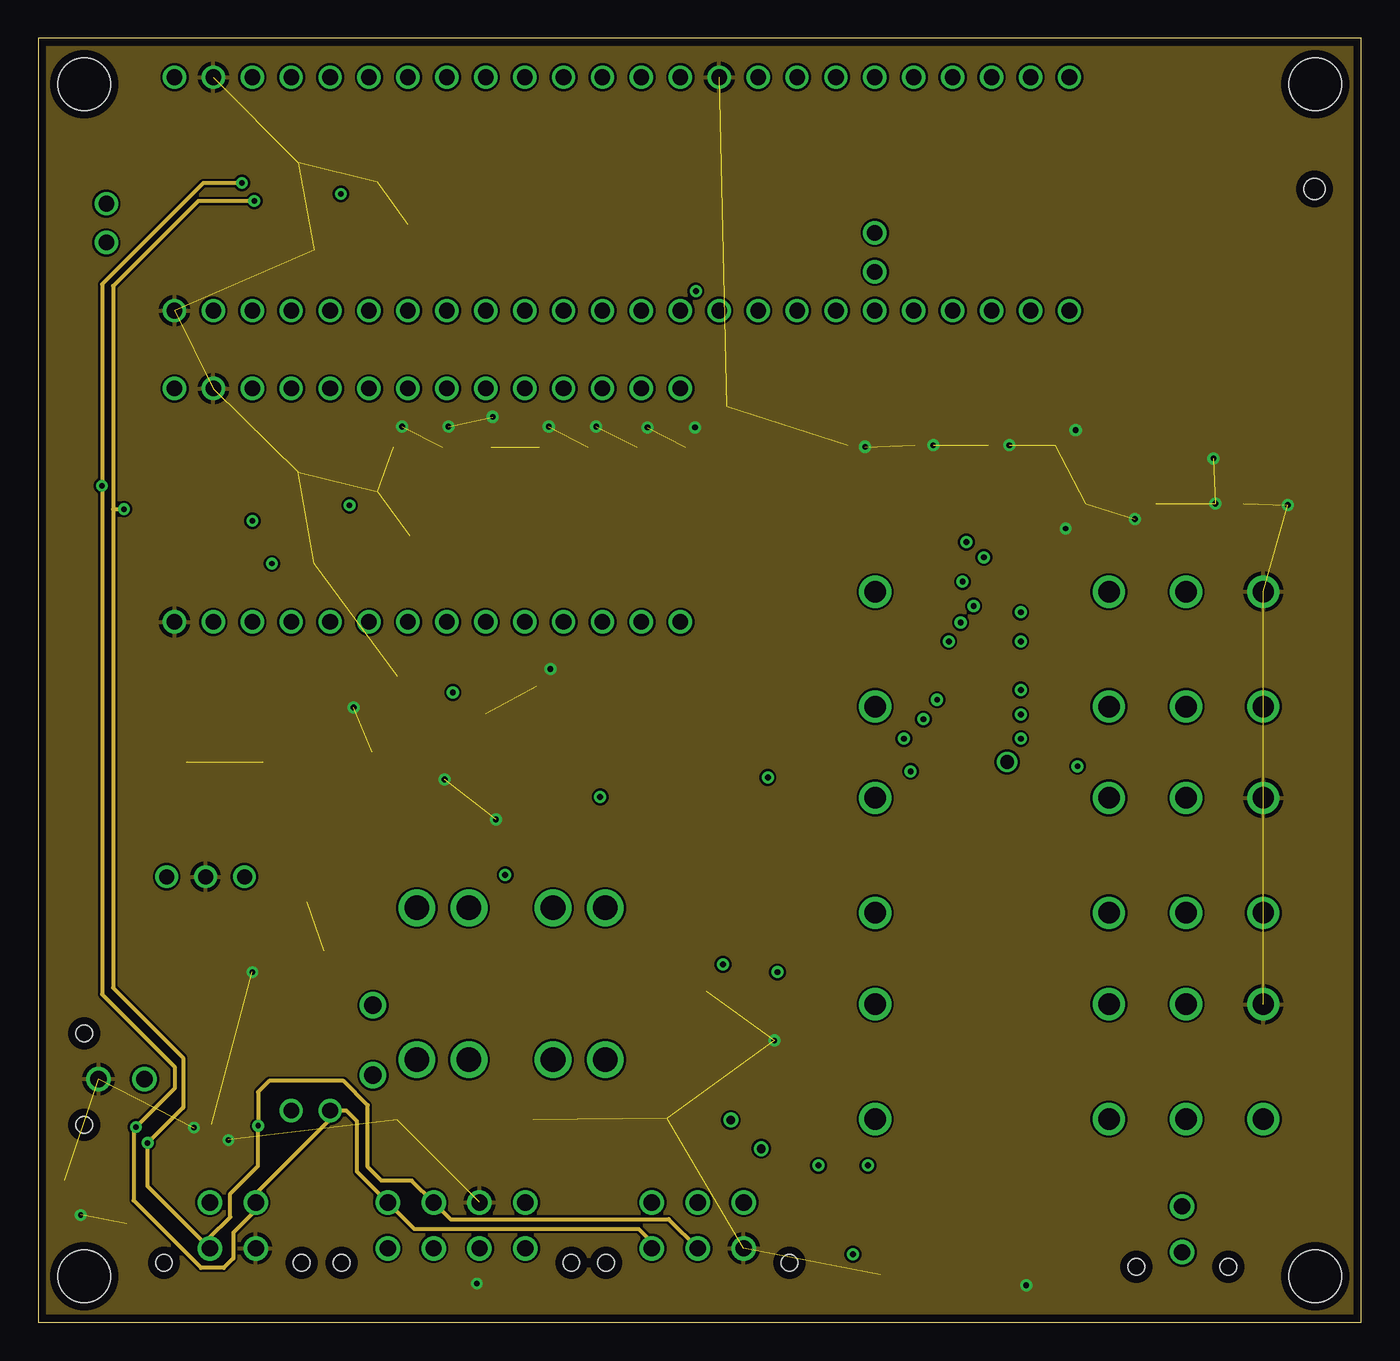
[diagram p5: board, inner layer Route2]
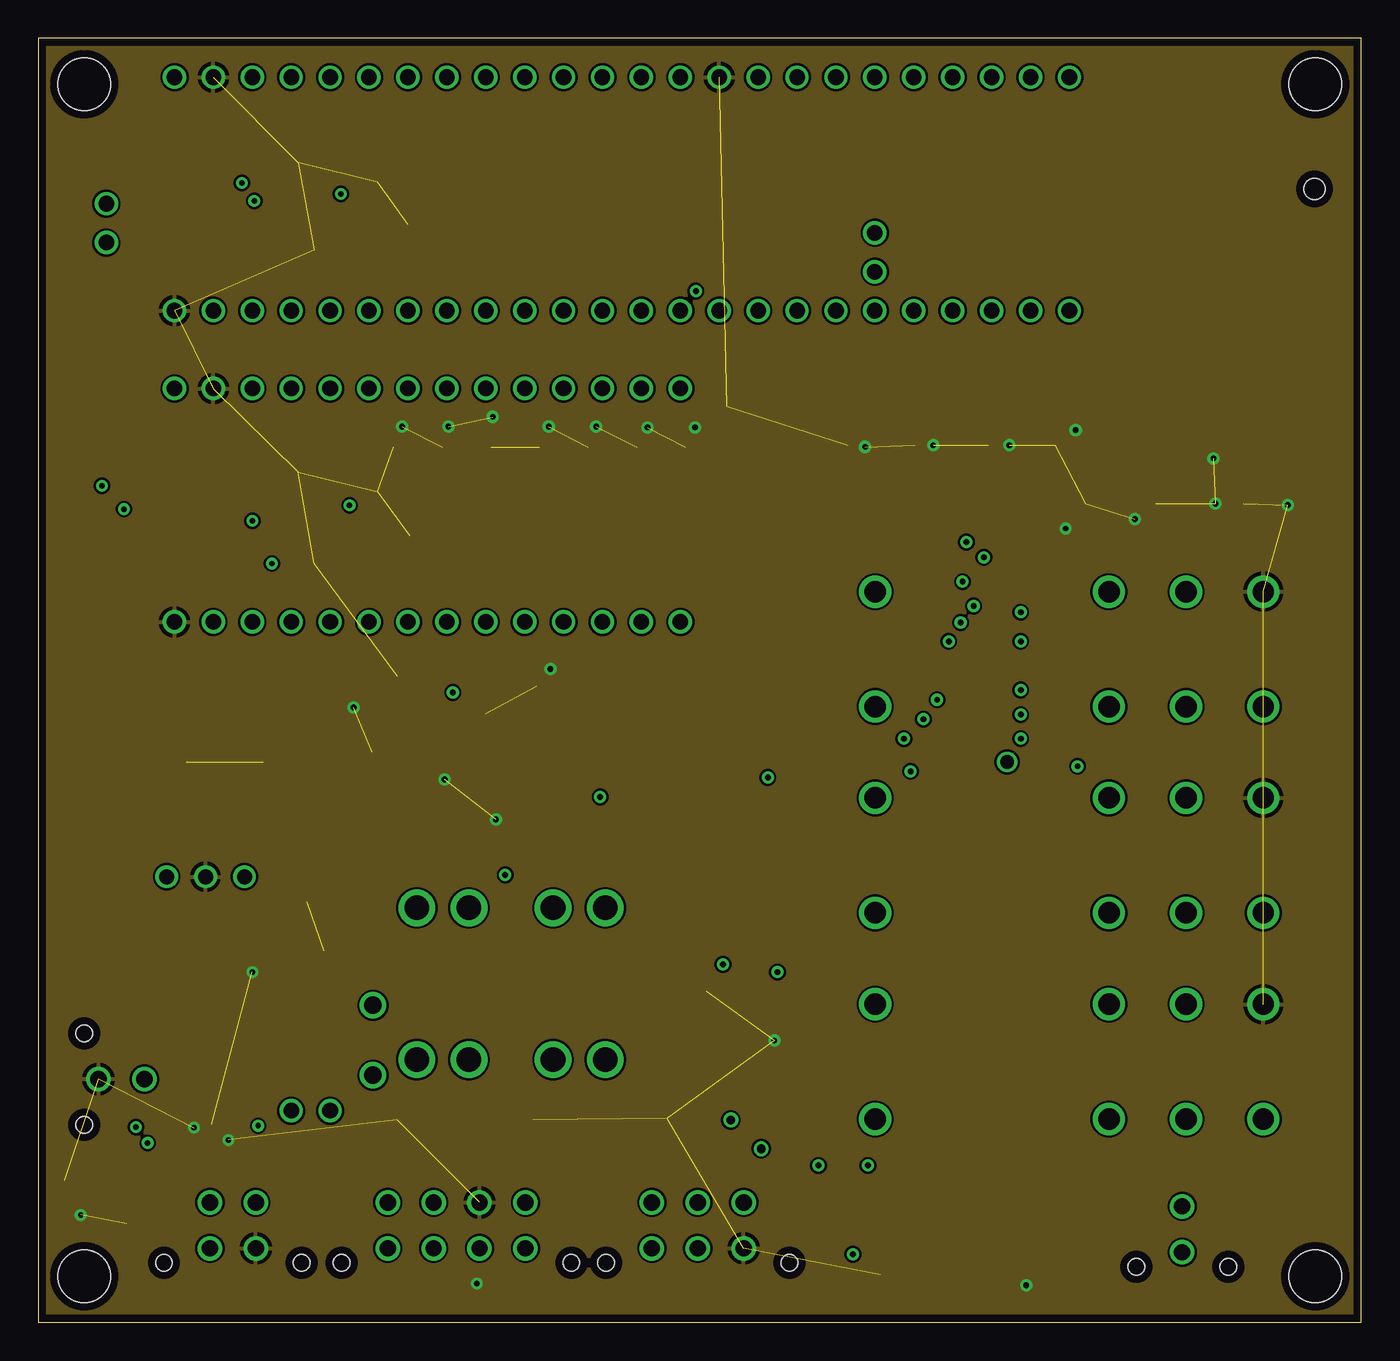
[diagram p6: board, inner layer Route15]
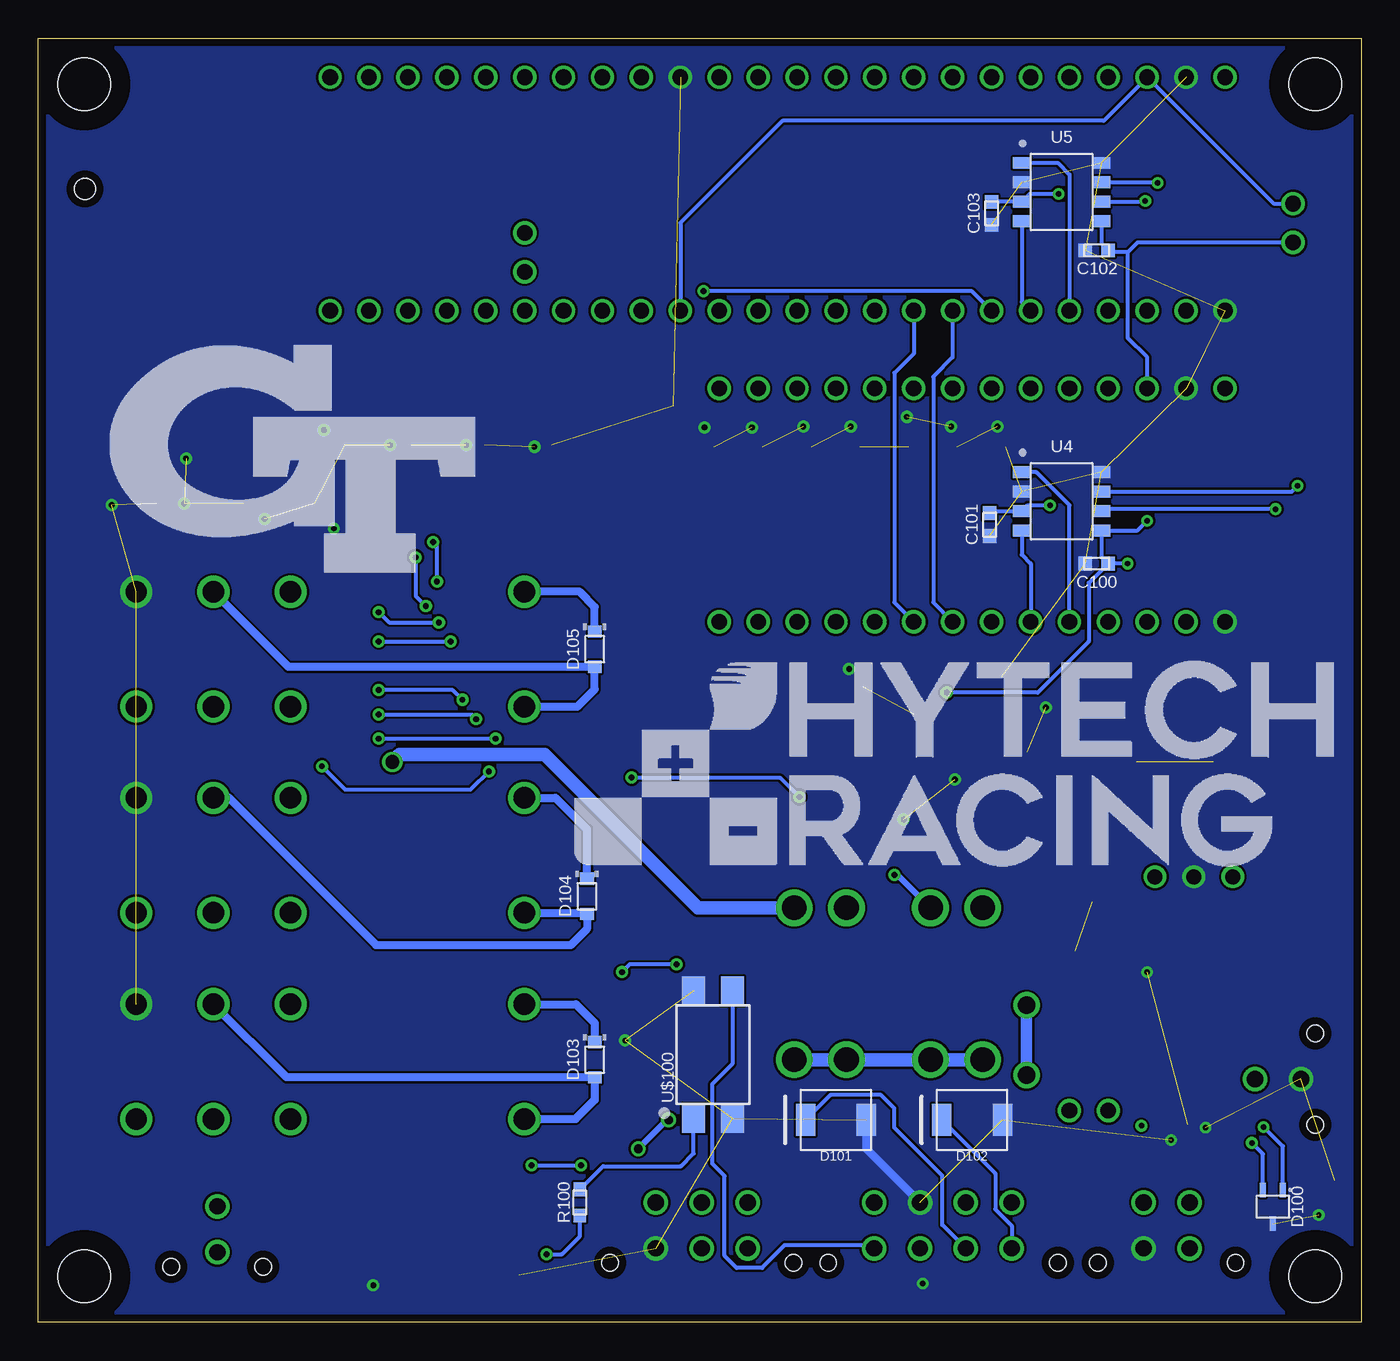
[diagram p7: board, bottom side, seen from below]

Size 86.36 x 83.82 mm. Coordinates in mm from the lower left corner, seen from the top.
Outline: 0,0 86.36,0 86.36,83.82 0,83.82 0,0
Copper layers (1+2*15+16): Top 0.035mm / dielectric 0.2mm / Route2 0.0175mm / dielectric 1.065mm / Route15 0.0175mm / dielectric 0.2mm / Bottom 0.035mm
Design rules "HyTech Default (4 Layer)": minimum track width 6mil, minimum drill 10mil, track to track 6mil, track to pad 6mil, pad to pad 6mil, via to via 20mil, smd to smd 6mil, copper to edge 20mil, drill to drill 21mil, minimum pad ring 8mil, minimum via ring 8mil, stop-mask expansion 3mil, vias tented up to drill 30mil, thermal gap 10mil

### Footprints (pad centres in the part's own frame; a part is rotated, then mirrored left to right if it is on the bottom)
1X02 = drill 1.016: 1 -1.27,0; 2 1.27,0
0603-LED = smd 0.8 x 0.8: 1 -0.825,0; 2 0.825,0
TEENSY_LONG_EXT = drill 1.016: 3V3 0,5.08; 3V3@2 15.24,35.56; 3V3@3 10.16,45.72; AGND/GND 0,2.54; D0 15.24,2.54; D1 15.24,5.08; D2 15.24,7.62; D3 15.24,10.16; D4 15.24,12.7; D5 15.24,15.24; D6 15.24,17.78; D7 15.24,20.32; D8 15.24,22.86; D9 15.24,25.4; D10 15.24,27.94; D11 15.24,30.48; D12 15.24,33.02; D13 0,33.02; D14 0,30.48; D15 0,27.94; D16 0,25.4; D17 0,22.86; D18 0,20.32; D19 0,17.78; D20 0,15.24; D21 0,12.7; D22 0,10.16; D23 0,7.62; D24 15.24,38.1; D25 15.24,40.64; D26 15.24,43.18; D27 15.24,45.72; D28 15.24,48.26; D29 15.24,50.8; D30 15.24,53.34; D31 15.24,55.88; D32 15.24,58.42; D33 0,58.42; D34 0,55.88; D35 0,53.34; D36 0,50.8; D37 0,48.26; D38 0,45.72; D39 0,43.18; D40 0,40.64; D41 0,38.1; GND 15.24,0; GND@2 0,35.56; VBAT 12.7,45.72; VIN 0,0
TEENSY_SHORT = drill 1.016: 3.3V 0,5.08; AGND/GND 0,2.54; D0 15.24,2.54; D1 15.24,5.08; D2 15.24,7.62; D3 15.24,10.16; D4 15.24,12.7; D5 15.24,15.24; D6 15.24,17.78; D7 15.24,20.32; D8 15.24,22.86; D9 15.24,25.4; D10 15.24,27.94; D11 15.24,30.48; D12 15.24,33.02; D13 0,33.02; D14 0,30.48; D15 0,27.94; D16 0,25.4; D17 0,22.86; D18 0,20.32; D19 0,17.78; D20 0,15.24; D21 0,12.7; D22 0,10.16; D23 0,7.62; GND 15.24,0; VIN 0,0
0603-CAP = smd 0.9 x 0.9: 1 -0.75,0; 2 0.75,0
0805-CAP = smd 0.95 x 1.4: 1 -0.925,0; 2 0.925,0
MOLEX_MICROFIT_PTH_VERTICAL_06_DUAL = drill 1.067: 1 2.997,-2.997; 2 0,-2.997; 3 -2.997,-2.997; 4 2.997,0; 5 0,0; 6 -2.997,0 | hole 1.067: 5.994,0.94; -5.994,0.94
SOD-323 = smd 0.8 x 0.9: A -1.15,0; C 1.15,0
DO-214AA = smd 1.27 x 2.1: 1 -1.98,0; 2 1.98,0
SC-70-3 = smd 0.95 x 0.4: 1 -1.1,0.65; 2 -1.1,-0.65; 3 1.1,0
0603-RES = smd 0.9 x 0.8: 1 -0.85,0; 2 0.85,0
MOLEX_MICROFIT_PTH_VERTICAL_04_DUAL = drill 1.067: 1 1.499,-2.997; 2 -1.499,-2.997; 3 1.499,0; 4 -1.499,0 | hole 1.067: 4.496,0.94; -4.496,0.94
RT*2* = drill 1.4: 11 0,3.75; 12 -5.04,3.75; 14 5.04,3.75; 21 0,-3.75; 22 -5.04,-3.75; 24 5.04,-3.75; A1 -20.3,3.75; A2 -20.3,-3.75
B3S-100X = smd 1.55 x 1.3: 1 3.975,-2.25; 2 -3.975,-2.25; 3 3.975,2.25; 4 -3.975,2.25
MOLEX_MICROFIT_PTH_VERTICAL_08_DUAL = drill 1.067: 1 4.496,-2.997; 2 1.499,-2.997; 3 -1.499,-2.997; 4 -4.496,-2.997; 5 4.496,0; 6 1.499,0; 7 -1.499,0; 8 -4.496,0 | hole 1.067: 7.493,0.94; -7.493,0.94
MOLEX_MICROFIT_PTH_VERTICAL_02_DUAL = drill 1.067: 1 0,-2.997; 2 0,0 | hole 1.067: 2.997,0.94; -2.997,0.94
5015 = smd 3.429 x 1.778: 1 0,0
SC-70-5 = smd 0.4 x 0.9: 1 -0.65,-1.1; 2 0,-1.1; 3 0.65,-1.1; 4 0.65,1.1; 5 -0.65,1.1
SOT-23-5 = smd 0.62 x 1.22: 1 -0.95,-1.31; 2 0,-1.31; 3 0.95,-1.31; 4 0.95,1.31; 5 -0.95,1.31
OKI-78SR = drill 0.991: 1 -2.54,0; 2 0,0; 3 2.54,0
SOIC-08(NARROW,0.15") = smd 0.762 x 1.143: 1 -1.905,-2.603; 2 -0.635,-2.603; 3 0.635,-2.603; 4 1.905,-2.603; 5 1.905,2.603; 6 0.635,2.603; 7 -0.635,2.603; 8 -1.905,2.603
MOUNTING_M3 = hole 3.4: 0,0
DIP-4@1 = smd 1.5 x 1.9: 1 -1.27,-4.15; 2 1.27,-4.15; 3 -1.27,4.15; 4 1.27,4.15
DIP-4 = smd 1.5 x 1.9: 1 -1.27,-4.15; 2 1.27,-4.15; 3 -1.27,4.15; 4 1.27,4.15
498 = smd 3.962 x 3.175: 1 -7.518,0; 2 7.518,0 | hole 1.346: -6.426,6.096
3568 = drill 1.6: 1 -4.953,1.702; 2 -4.953,-1.702; 3 4.953,-1.702; 4 4.953,1.702

### Placement (x,y rotation side)
4.1_ONLY  4.45,71.75 270 top
5V_PWR  18.16,36.09 180 top
A1  8.89,81.28 270 top
A2  8.89,60.96 270 top
BMS_OK  73.76,51.74 180 top
C1  32.51,40.77 270 top
C2  25.63,37.16 90 top
C3  27.46,37.13 90 top
C4  10.41,36.58 0 top
C5  13.92,36.58 0 top
C6  18.29,27.43 180 top
C7  7.26,36.32 0 top
C8  11.33,13.67 270 top
C100  17.27,49.53 0 bottom
C101  24.26,52.07 90 bottom
C102  17.27,69.98 0 bottom
C103  24.13,72.39 90 bottom
CAN_TERM  17.78,13.82 0 top
CCU_OK  83.69,51.74 180 top
CHG_CAN  43.05,4.83 180 top
D1  46.79,39.6 180 top
D2  46.86,26.92 180 top
D3  49.05,16.76 270 top
D4  46.84,14.55 180 top
D5  3.71,9.27 0 top
D100  5.77,7.54 270 bottom
D101  34.29,13.21 180 bottom
D102  25.4,13.21 180 bottom
D103  50.04,17.14 90 bottom
D104  50.55,27.81 90 bottom
D105  50.04,43.94 90 bottom
E_SELECT  52.35,3.38 0 top
F_SELECT  52.35,1.83 0 top
J1  12.7,4.83 180 top
K1  74.93,43.94 0 top
K2  74.93,30.48 0 top
K3  74.93,17.02 0 top
LATCH  42.8,19.81 180 top
LATCH_BUTTON  58.95,5.36 180 top
MAIN_CONNECTOR  27.3,4.83 180 top
OKHS  79.53,51.74 180 top
POWER  3.94,15.88 90 top
R1  45.77,59.82 180 top
R2  73.81,53.44 180 top
R3  51.94,59.05 180 top
R4  56.52,59.05 180 top
R5  61.34,59.05 180 top
R6  65.41,59.05 180 top
R7  79.53,53.44 180 top
R8  69.22,53.44 180 top
R9  83.67,53.44 180 top
R10  22.35,57.15 0 top
R11  25.53,57.15 0 top
R12  28.7,57.15 0 top
R13  31.88,57.15 0 top
R14  35.05,57.15 0 top
R15  38.23,57.15 0 top
R16  41.4,57.15 0 top
R17  22.35,55.24 180 top
R18  25.53,55.24 180 top
R19  28.7,55.24 180 top
R20  31.88,55.24 180 top
R21  35.05,55.24 180 top
R22  38.23,55.24 180 top
R23  41.4,55.24 180 top
R24  -1.52,-4.83 0 top  (outside the outline)
R25  50.8,46.61 270 top
R26  14.48,40.13 270 top
R27  23.47,41.3 90 top
R28  21.72,41.27 270 top
R29  34.42,40.77 270 top
R30  21.79,38.07 90 top
R31  23.42,38.07 90 top
R32  18.16,38 180 top
R33  -1.52,-7.62 0 top  (outside the outline)
R34  50.8,32.64 270 top
R35  42.8,21.46 0 top
R37  50.8,20.14 270 top
R38  50.8,16.71 270 top
R39  12.6,16.21 0 top
R40  13.23,13.67 90 top
R100  51,7.82 90 bottom
SHDN_B  52.02,57.28 180 top
SHDN_BTN  74.68,4.57 180 top
SHDN_C  56.39,57.28 180 top
SHDN_D  61.21,57.28 180 top
SHDN_E  65.53,57.28 180 top
SHDN_F  69.27,51.74 180 top
STATUS_4.0  17.4,41.4 0 top
STATUS_4.1  45.8,61.47 180 top
TP1  18.67,24.26 180 top
TP2  52.07,61.59 0 top
TP3  56.52,61.59 180 top
TP4  60.96,61.59 0 top
TP5  65.41,61.59 0 top
TP6  69.34,55.5 0 top
TP7  73.79,55.5 0 top
TP8  79.6,55.47 0 top
TP9  83.69,55.5 0 top
TP10  46.35,57.15 180 top
TP11  5.08,48.64 90 top
TP12  18.92,29.97 0 top
TP13  18.67,20.57 0 top
U1  25.65,41.02 180 top
U2  29.21,41.02 0 top
U3  10.92,29.08 0 top
U4  19.56,53.59 270 bottom
U5  19.56,73.79 270 bottom
U$1  [MOUNTING_M3]  3,80.82 0 top
U$2  [MOUNTING_M3]  83.36,80.82 0 top
U$3  [LOGO_HYTECH_SMALL]  3.81,22.86 90 top
U$4  35.89,34.14 270 top
U$6  [MOUNTING_M3]  3,3 0 top
U$7  [MOUNTING_M3]  83.36,3 0 top
U$9  [LOGO_HYTECH_LARGE]  51.44,29.84 0 bottom
U$10  [LOGO_GT_LARGE]  69.77,56.36 0 bottom
U$100  42.32,17.48 0 bottom
XB1  77.22,67.56 270 top
XF1  26.42,22.1 90 top
XF2  35.31,22.1 90 top

### Tracks (layer width: path | path; a pad name or v marks a point on that pad's centre or on a via)
4.0_CRX
  Top 0.254: A2.D0 14.22,42.93 18.8,42.93 A2.D4
  Bottom 0.152: 21.58,49.53 21.58,49.54 21.59,49.54
  Bottom 0.254: 21.58,49.53 21.58,45.73 A2.D4 | U4.4 22.16,50.11 21.59,49.54
4.0_CTX
  Top 0.254: A2.D3 17.53,44.2 15.49,44.2 A2.D1
  Bottom 0.254: A2.D3 19.05,53.34 21.21,55.5 U4.1
4.1_CRX
  Top 0.254: A1.D0 13.46,64.01 19.56,64.01 A1.D4
  Bottom 0.254: U5.4 22.16,66.61 A1.D4
4.1_CTX
  Top 0.254: A1.D3 17.53,64.52 15.49,64.52 A1.D1
  Bottom 0.254: U5.1 19.81,75.69 19.05,74.93 A1.D3
24V_READ
  Top 0.254: R17.2 R10.1 21.5,58.33 A2.D20 25.35,62.18 25.35,80.06 A1.D20
+3V3  (via drill 0.36, 0.38)
  Top 0.254: TP11.1 14.35,48.64 v15.24,49.53 | U2.5 27.06,41.13 v27.06,41.11 26.3,40.36 U1.5 26.3,37.92 26.31,37.91 | C2.2 26.31,37.91 | 26.31,37.91 27.43,37.91 C3.2 | v13.97,52.32 A2.3.3V
  Bottom 0.254: 15.24,69.85 14.61,70.48 4.1_ONLY.2 | 15.24,69.85 16.39,69.85 C102.2 16.95,70.41 U5.5 | A2.3.3V 13.97,62.99 15.24,64.26 15.24,69.85 | C100.2 17.78,48.27 17.78,44.45 21.12,41.11 v27.06,41.11 | v15.24,49.53 C100.2 | C100.2 16.95,49.96 U4.5 14.61,51.69 v13.97,52.32
+5V  (via drill 0.36)
  Top 0.152: 19.04,29.86 TP12.1
  Top 0.254: LATCH.2 33.53,19.81 30.99,22.35 30.99,27.43 28.96,29.46 19.43,29.46 TP12.1 | 5V_PWR.2 17.34,35.56 17.78,35.12 17.78,31.11 TP12.1 | A2.VIN 11.43,58.42 11.43,53.34 13.72,51.05 18.03,51.05 v20.32,53.34 | TP12.1 14.35,29.97 U3.3 | v19.76,73.66 16.26,73.66 8.89,81.03 | C6.1 19.04,29.86
  Top 0.508: C4.2 12.19,36.58 | C5.1 12.19,36.58 | 12.19,36.58 12.19,30.35 U3.3 | 12.19,36.58 12.19,37.08 7.62,41.66 5.92,41.66 2.79,44.78 2.79,60.71 | 2.79,60.71 2.79,74.93 8.89,81.03 A1.VIN | A2.VIN 8.64,60.71 2.79,60.71
  Bottom 0.254: C103.2 22.17,73.14 U5.3 21.65,73.66 v19.76,73.66 | C101.2 24.12,52.96 U4.3 21.78,53.34 v20.32,53.34
+24V  (via drill 0.38, 1.14)
  Top 0.254: 37.47,32.77 37.47,34.92 35.56,36.83 35.56,49.53 34.29,50.8 27.65,50.8 R17.1 | U3.1 6.34,31.13 C7.1
  Top 0.381: v30.48,29.21 34.04,32.77 37.47,32.77 39.94,32.77 U$4.4
  Top 0.762: XF1.3 XF1.4 21.84,27.05 21.84,25.78 | 21.84,25.78 11.68,25.78 U3.1 | MAIN_CONNECTOR.4 33.33,6.3 33.33,3.67 31.21,1.55 21.26,1.55 | 21.26,1.55 21.26,15.54 v21.84,16.13 | 21.84,20.57 v21.84,20.7 21.84,25.78 | 21.26,1.55 12.42,1.55 9.87,4.1 9.87,6.49 J1.1
  Top 1.016: TP13.1 21.84,20.57
  Bottom 0.381: XF1.3 30.28,29.21 v30.48,29.21
  Bottom 0.762: v21.84,16.13 v21.84,20.7
BMS_OK  (via drill 0.38)
  Top 0.254: TP7.1 73.79,52.59 BMS_OK.2 72.43,51.23 70.91,51.23 67.31,47.64 67.31,42.77 64.21,39.67 v64.14,39.67 | v57.78,39.37 57.78,33.02 56.52,31.75 50.84,31.75 R34.2
  Top 0.381: MAIN_CONNECTOR.6 25.81,5.33 27.33,6.86 27.33,8.38 29.92,10.97 45.52,10.97 47.24,12.7 47.24,30.99 48.05,31.79 R34.2
  Bottom 0.254: v57.78,39.37 58.08,39.67 v64.14,39.67 | MAIN_CONNECTOR.6 27.34,6.36 27.34,9.56 30.48,12.7 30.48,13.97 31.34,14.83 34.64,14.83 D101.2
CANH  (via drill 0.36)
  Route2 0.254: v13.28,74.37 10.77,74.37 4.17,67.77 v4.17,54.61 4.17,21.41 8.89,16.69 8.89,15.27 v6.38,12.75 6.22,12.6 6.22,7.95 10.62,3.56 12.12,3.56 12.72,4.17 12.72,5.84 14.2,7.32 J1.2 14.2,8.38 19.05,13.23 CAN_TERM.2 20.12,13.82 20.8,13.13 20.8,9.83 MAIN_CONNECTOR.1 24.54,6.1 39.19,6.1 40.06,5.23 CHG_CAN.4
  Bottom 0.254: U5.7 13.34,74.42 v13.28,74.37 | D100.1 5.12,11.49 v6.38,12.75 | U4.7 4.55,54.23 v4.17,54.61
CANL  (via drill 0.36)
  Top 0.254: R40.1 14.34,12.81 v14.35,12.83
  Route2 0.254: v14.1,73.2 10.44,73.2 4.88,67.64 4.88,53.09 | CHG_CAN.5 41.15,6.73 26.9,6.73 MAIN_CONNECTOR.2 24.38,9.25 22.4,9.25 21.51,10.13 21.51,14.17 19.94,15.75 15.06,15.75 14.35,15.04 v14.35,12.83 14.35,10.21 12.54,8.39 12.54,6.87 11.2,5.54 J1.3 7.14,8.89 v7.14,11.71 9.4,13.97 9.42,13.97 9.45,13.99 9.45,17.27 4.88,21.84 4.88,53.09 | 4.88,53.09 v5.59,53.09
  Bottom 0.254: U5.6 14.1,73.15 v14.1,73.2 | D100.2 6.42,10.99 v7.14,11.71 | v5.59,53.09 16.83,53.09 U4.6
CCU_OK  (via drill 0.38)
  Top 0.254: U1.4 25,39.63 24.29,38.92 R31.2 R30.2 20.95,38.1 20.95,34.92 21.79,34.09 36.48,34.09 v36.68,34.29 | v56.95,35.97 48.03,35.97 v47.62,35.56 | v67.84,36.3 67.87,36.32 73.41,36.32 82.42,45.34 82.42,51.3 CCU_OK.2 83.69,52.56 83.69,55.09 84.1,55.5 TP9.1
  Bottom 0.254: v67.84,36.3 66.32,34.77 58.14,34.77 v56.95,35.97 | v47.62,35.56 37.95,35.56 v36.68,34.29
GND  (via drill 0.36, 0.38)  (47 unrouted)
  Top 0.152: v42.88,58.42 43.52,58.42 R1.2 | R32.2 17.21,38.1
  Top 0.254: U1.3 23.5,42.12 R27.2 21.74,40.42 R28.2 21.42,40.13 v20.57,40.13 19.45,40.13 R32.2 | C1.1 33.43,41.52 | 33.43,41.52 34.32,41.52 R29.1 | A2.GND 8.89,44.87 R26.2 14.67,39.09 14.67,38.1 | R30.1 22.67,38.1 23.94,38.1 C2.1 26.52,36.41 | 33.43,41.52 v33.43,42.65 | 26.52,36.41 v26.52,35.43 | D3.1 49.05,17.84 48.5,18.39 v48.04,18.39 | LATCH_BUTTON.3 LATCH_BUTTON.4 63.62,2.41 v64.49,2.41 | R10.2 23.2,57.92 v23.75,58.47 | R11.2 26.38,58.08 v26.77,58.47 | R12.2 29.55,58.99 v29.67,59.11 | R13.2 32.73,57.87 v33.33,58.47 | R14.2 36.42,57.67 v36.42,58.47 | R15.2 39.08,57.72 v39.78,58.42 | R16.2 42.25,57.8 v42.88,58.42 | SHDN_B.1 52.97,57.15 v53.98,57.15 | SHDN_C.1 58.4,57.28 v58.42,57.25 | SHDN_D.1 63.37,57.28 v63.4,57.25 | R2.2 71.95,52.43 v71.58,52.43 | R7.2 v76.83,53.44 | R9.2 81.66,53.44 v81.56,53.34 | 17.21,38.1 14.67,38.1 | 26.52,36.41 27.43,36.41 C3.1 28.13,36.38 29.21,37.47 U2.2 | U$4.2 29.92,32.87 v29.87,32.82 | SHDN_E.1 67.32,58.24 v67.72,58.24 | 12.35,11.9 C8.2 11.11,12.7 v10.16,12.7 | 12.35,11.9 v12.4,11.9 | v67.06,51.82 67.06,52.13 R8.2 | XB1.2 77.22,56.9 v76.71,56.39 | 14.67,38.1 C5.2 | v2.77,7.01 1.73,8.05 D5.1 | C4.1 9.66,34.29 | 9.66,34.29 9.66,30.34 U3.2 12.57,27.43 C6.2 | J1.4 12.7,6.33 12.7,11.54 12.35,11.9 | 9.66,34.29 8.19,35.77 C7.2 | TP1.1 15.37,24.26 v13.97,22.86
  Top 0.508: MAIN_CONNECTOR.3 28.8,7.21 27.34,5.75 27.34,3.82 v28.63,2.54
  Bottom 0.508: MAIN_CONNECTOR.3 32.31,11.33 D101.1
  pour Bottom (no thermals): 0.25,83.82 0.25,0 0,-0.25 86.11,-0.25 86.36,0 86.36,83.82
  pour Route2: -3.3,85.85 89.66,85.85 89.66,-1.78 88.65,-2.79 -3.56,-2.79 -3.56,85.85
  pour Route15: -2.29,85.09 88.65,85.09 88.65,-1.78 -2.29,-1.78
IMD_OK  (via drill 0.38)
  Top 0.254: TP8.1 79.63,55.45 79.63,52.67 OKHS.2 76.33,51.74 68.2,43.61 68.2,42.16 v64.14,38.1 | v56.52,38.1 46.48,38.1
  Top 0.381: MAIN_CONNECTOR.5 24.33,6.35 24.33,8.89 27.23,11.79 45.06,11.79 46.48,13.21 46.48,38.1 46.48,44.45 47.79,45.76 R25.2
  Bottom 0.254: v64.14,38.1 v56.52,38.1 | D102.2 23.89,9.72 23.89,7.38 22.81,6.3 MAIN_CONNECTOR.5
LATCH_BUTTON  (via drill 0.56)
  Top 0.254: R35.2 45.59,21.46
  Top 0.381: D1.C 45.64,27 D2.C 45.71,21.34 | 45.71,21.34 45.71,14.58 D4.C 45.69,13.68 v45.21,13.21 | v47.2,11.32 51.26,11.32 LATCH_BUTTON.1 | 45.59,21.46 45.71,21.34
  Top 0.508: LATCH_BUTTON.2 LATCH_BUTTON.1
  Bottom 0.381: v47.2,11.32 45.31,13.21 v45.21,13.21
N$1
  Top 0.152: POWER.1 6.93,15.82
  Top 0.254: D5.2 5.08,9.88 5.08,13.97 6.93,15.82
  Top 0.889: XF1.1 23.44,18.41 9.47,18.41 POWER.1
  Bottom 0.889: XF1.1 XF1.2 XF2.1 XF2.2
N$2
  Top 0.254: R27.1 23.91,40.89 25.15,40.89 25.65,41.4 U1.2 25.65,42.8 26.21,43.36 28.73,43.36 29.21,42.88 29.21,41.91 28.26,40.96 U2.1
N$3
  Top 0.254: R8.1 70.09,53.42 SHDN_F.1
N$4
  Top 0.254: CAN_TERM.1 14.12,16.2 R39.2
N$5  (via drill 0.38)
  Top 0.254: F_SELECT.2 E_SELECT.2 53.2,4.43 v53.19,4.45
  Bottom 0.254: v53.19,4.45 52.17,4.45 51,5.61 R100.1
N$6
  Top 0.254: R31.1 23.42,36.27 25.02,34.67 31,34.67 U$4.1
N$8
  Top 0.254: A1.VBAT 56.9,68.58 57.8,69.49 57.8,72.42 60.46,75.08 XB1.1
N$9
  Top 0.254: R40.2 13.13,14.41 C8.1 11.75,14.84 R39.1
N$10
  Bottom 0.254: R100.2 49.48,10.2 44.41,10.2 43.59,11.02 U$100.1
N$11
  Top 0.381: D1.A 54.04,39.6 K1.A2
  Bottom 0.508: K1.A2 51.16,40.19 50.04,41.32 D105.A 70.03,42.79 K1.11
N$12
  Top 0.254: 54.4,47.46 K1.A1
  Top 0.381: R25.1 54.4,47.46
  Bottom 0.508: D105.C 50.04,46.71 51.02,47.69 K1.A1
N$13
  Top 0.381: R34.1 53.89,33.49 K2.A1
  Bottom 0.508: K2.A1 52.6,34.23 50.55,32.18 D104.C
N$14
  Top 0.381: D2.A 54.44,26.92 K2.A2
  Bottom 0.508: K2.A2 50.61,26.73 D104.A 50.55,25.67 51.59,24.63 64.31,24.63 73.91,34.23 K2.11
N$15
  Top 0.381: R37.1 54.41,20.99 K3.A1
  Bottom 0.508: K3.A1 51.27,20.77 50.04,19.54 D103.C
N$16  (via drill 0.38)
  Top 0.254: v44.7,23.37 44.7,33.4 42.7,35.41 U$4.3 | v48.26,22.86 47.93,22.53 47.93,20.17 48.65,19.44 50.65,19.44 50.83,19.27
  Top 0.381: R37.2 50.83,19.27 50.83,17.59 R38.1
  Bottom 0.254: v44.7,23.37 47.75,23.37 v48.26,22.86
N$17
  Top 0.254: 41.97,21.46 LATCH.1
  Top 0.381: R35.1 41.97,21.46
N$18
  Top 0.254: R5.2 60.49,57.38 SHDN_D.2
N$19
  Top 0.254: R6.2 64.56,57.43 SHDN_E.2
N$20
  Top 0.381: D4.A 53.34,14.55 K3.A2
  Bottom 0.508: K3.A2 51.28,13.27 50.04,14.51 D103.A 70.16,15.99 K3.11
N$21
  Top 0.381: R38.2 49.12,15.86 D3.2
N$22
  Top 0.254: R4.2 55.66,57.38 SHDN_C.2
N$23
  Top 0.254: R3.2 51.09,57.38 SHDN_B.2
N$29
  Top 0.254: OKHS.1 80.38,51.77 R7.1
N$30
  Top 0.254: R2.1 74.66,51.82 BMS_OK.1
N$31
  Top 0.254: R9.1 CCU_OK.1
N$33
  Top 0.254: STATUS_4.0.1 14.9,41.4 R26.1
N$35
  Top 0.254: 5V_PWR.1 18.99,37.97 R32.1
N$36
  Top 0.254: A1.3V3@3 46.74,71.12 44.45,68.83 A1.3V3@2
  Bottom 0.254: 4.1_ONLY.1 5.71,73.03 A1.3V3 16.82,78.44 37.8,78.44 44.45,71.78 A1.3V3@2
N$39
  Top 0.254: STATUS_4.1.1 | STATUS_4.1.1 R1.1
RPC_SWITCH
  Bottom 0.254: U$100.4 41.05,16.87 42.37,15.54 42.37,10.36 41.55,9.55 41.55,4.34 40.77,3.56 39.12,3.56 37.62,5.05 32.03,5.05 MAIN_CONNECTOR.8
SHDN_A  (via drill 0.89)
  Top 0.254: v63.25,36.58 63.25,46.91 54.91,55.24 46.35,55.24 | 46.35,55.24 R23.1 | TP10.1 46.35,55.24
  Top 0.889: XF2.4 XF2.3 | K1.21 73.91,40.19 71.82,38.1 66.8,38.1 65.28,36.58 v63.25,36.58
  Bottom 0.889: v63.25,36.58 62.76,37.06 53.31,37.06 43.31,27.05 XF2.3
SHDN_A_READ
  Top 0.254: R23.2 R16.1 40.55,59.78 A2.D14 40.64,62.23 40.64,80.01 A1.D14
SHDN_B  (via drill 0.38)
  Top 0.254: K2.21 72.2,29.46 68.07,29.46 61.98,35.56 61.98,47.19 60.82,48.35 v60.34,48.35 54.12,54.57 39.67,54.57 39.08,55.16 R22.1 | TP2.1 52.7,61.59 52.79,61.51 R3.1 52.07,58.33 52.07,56.52 52.7,55.88 55.58,55.88 60.54,50.93 v60.59,50.93
  Top 0.889: K1.24 77.47,37.69 77.47,29.27 K2.21
  Bottom 0.254: v60.34,48.35 60.34,50.68 v60.59,50.93
SHDN_B_READ
  Top 0.254: R22.2 R15.1 37.38,60.41 A2.D15 38.1,62.23 38.1,80.01 A1.D15
SHDN_C  (via drill 0.38)
  Top 0.254: K3.21 72.45,15.75 70.1,15.75 61.06,24.79 v61.06,46.76 60.73,46.76 53.65,53.85 37.3,53.85 R21.1 | TP3.1 57.37,60.74 R4.1 57.37,58.81 56.36,57.81 56.36,56.34 61.72,50.98 v61.72,49.94
  Top 0.889: K2.24 77.47,24.23 77.47,15.81 K3.21
  Bottom 0.254: v61.72,49.94 61.72,47.42 v61.06,46.76
SHDN_C_READ
  Top 0.254: R21.2 R14.1 34.2,60.87 A2.D16 35.56,62.23 35.56,80.01 A1.D16
SHDN_D  (via drill 0.38)
  Top 0.254: R20.1 34.89,53.09 53.39,53.09 60.21,46.26 v60.21,45.69 60.22,45.68 60.22,16.23 67.94,8.52 73.73,8.52 SHDN_BTN.1 | TP4.1 61.59,61.59 62.19,61 R5.1 61.24,58.1 61.24,54.33 64.14,51.44 v64.14,46.35
  Top 0.889: K3.24 79.97,9.87 77.67,7.57 SHDN_BTN.1
  Bottom 0.254: v64.14,46.35 63.47,45.69 v60.21,45.69
SHDN_D_READ
  Top 0.254: R20.2 R13.1 31.03,60.24 A2.D17 32.99,62.2 32.99,80.03 A1.D17
SHDN_E  (via drill 0.38)
  Top 0.254: R19.1 32.47,52.32 53.16,52.32 59.44,46.05 v59.44,44.45 59.44,15.49 59.44,15.24 67.06,7.62 67.06,5.69 | TP5.1 66.25,60.74 R6.1 65.41,58.2 65.41,45.72 v64.14,44.45
  Top 0.889: SHDN_BTN.2 73.56,5.69 69.6,5.69 67.06,5.69 51.31,5.69 | CHG_CAN.3 48.18,5.69 51.31,5.69 | 51.31,5.69 51.5,5.5 E_SELECT.1
  Bottom 0.254: v64.14,44.45 v59.44,44.45
SHDN_E_READ
  Top 0.254: R19.2 R12.1 27.85,59.6 A2.D18 30.48,62.23 30.48,80.01 A1.D18
SHDN_F  (via drill 0.38)
  Top 0.254: v54.15,10.24 55.17,10.24 58.67,13.74 v58.67,40.64 58.67,45.9 53.01,51.56 30.06,51.56 R18.1 | TP6.1 69.22,55.37 69.22,53.02 68.44,52.25 SHDN_F.2 66.4,49.7 66.4,43.54 v64.14,41.27 | CHG_CAN.2 44.88,9.65 50.34,9.65 v50.93,10.24
  Top 0.889: MAIN_CONNECTOR.7 30.33,6.35 30.33,8.38 31.47,9.53 38.35,9.53 CHG_CAN.1 CHG_CAN.2 44.52,6.36 44.52,4.32 47.01,1.83 F_SELECT.1
  Bottom 0.254: v54.15,10.24 v50.93,10.24 | v58.67,40.64 59.31,41.27 v64.14,41.27
SHDN_F_READ
  Top 0.254: R18.2 R11.1 24.68,58.97 A2.D19 27.94,62.23 27.94,80.01 A1.D19
STATUS_4.0
  Top 0.254: STATUS_4.0.2 19.24,41.4 23.56,45.72 A2.D5
STATUS_4.1  (via drill 0.38)
  Top 0.254: v42.93,67.31 43.18,67.06 43.18,63.26 STATUS_4.1.2
  Bottom 0.254: A1.D5 25.4,67.31 v42.93,67.31
SW_SHUTDOWN
  Top 0.254: A2.D6 27.94,46.99 29.46,46.99 30.48,45.97 30.48,44.45 31.11,43.81 31.11,39.71 | R29.2 32.61,39.92 C1.2 32.21,39.71 31.11,39.71 | U2.3 31.11,39.71
  Bottom 0.254: A1.D6 26.67,62.99 27.94,61.72 27.94,46.99 A2.D6
WATCHDOG_IN
  Top 0.254: 29.21,43.94 A2.D7 | R28.1 23.53,43.94 29.21,43.94 | U2.4 30.16,42.99 29.21,43.94
  Bottom 0.254: A1.D7 29.21,63.25 30.48,61.98 30.48,46.99 A2.D7

### Text on the board
tNames: SHDN_C | HyTech Racing 2023 Charger Control Unit rev8 / Designed by Zheng-Yin Lee